# EAGLE schematic TurtleBoard (EAGLE 7.7.0)
REV: 1V1

## Sheet 1 of 7
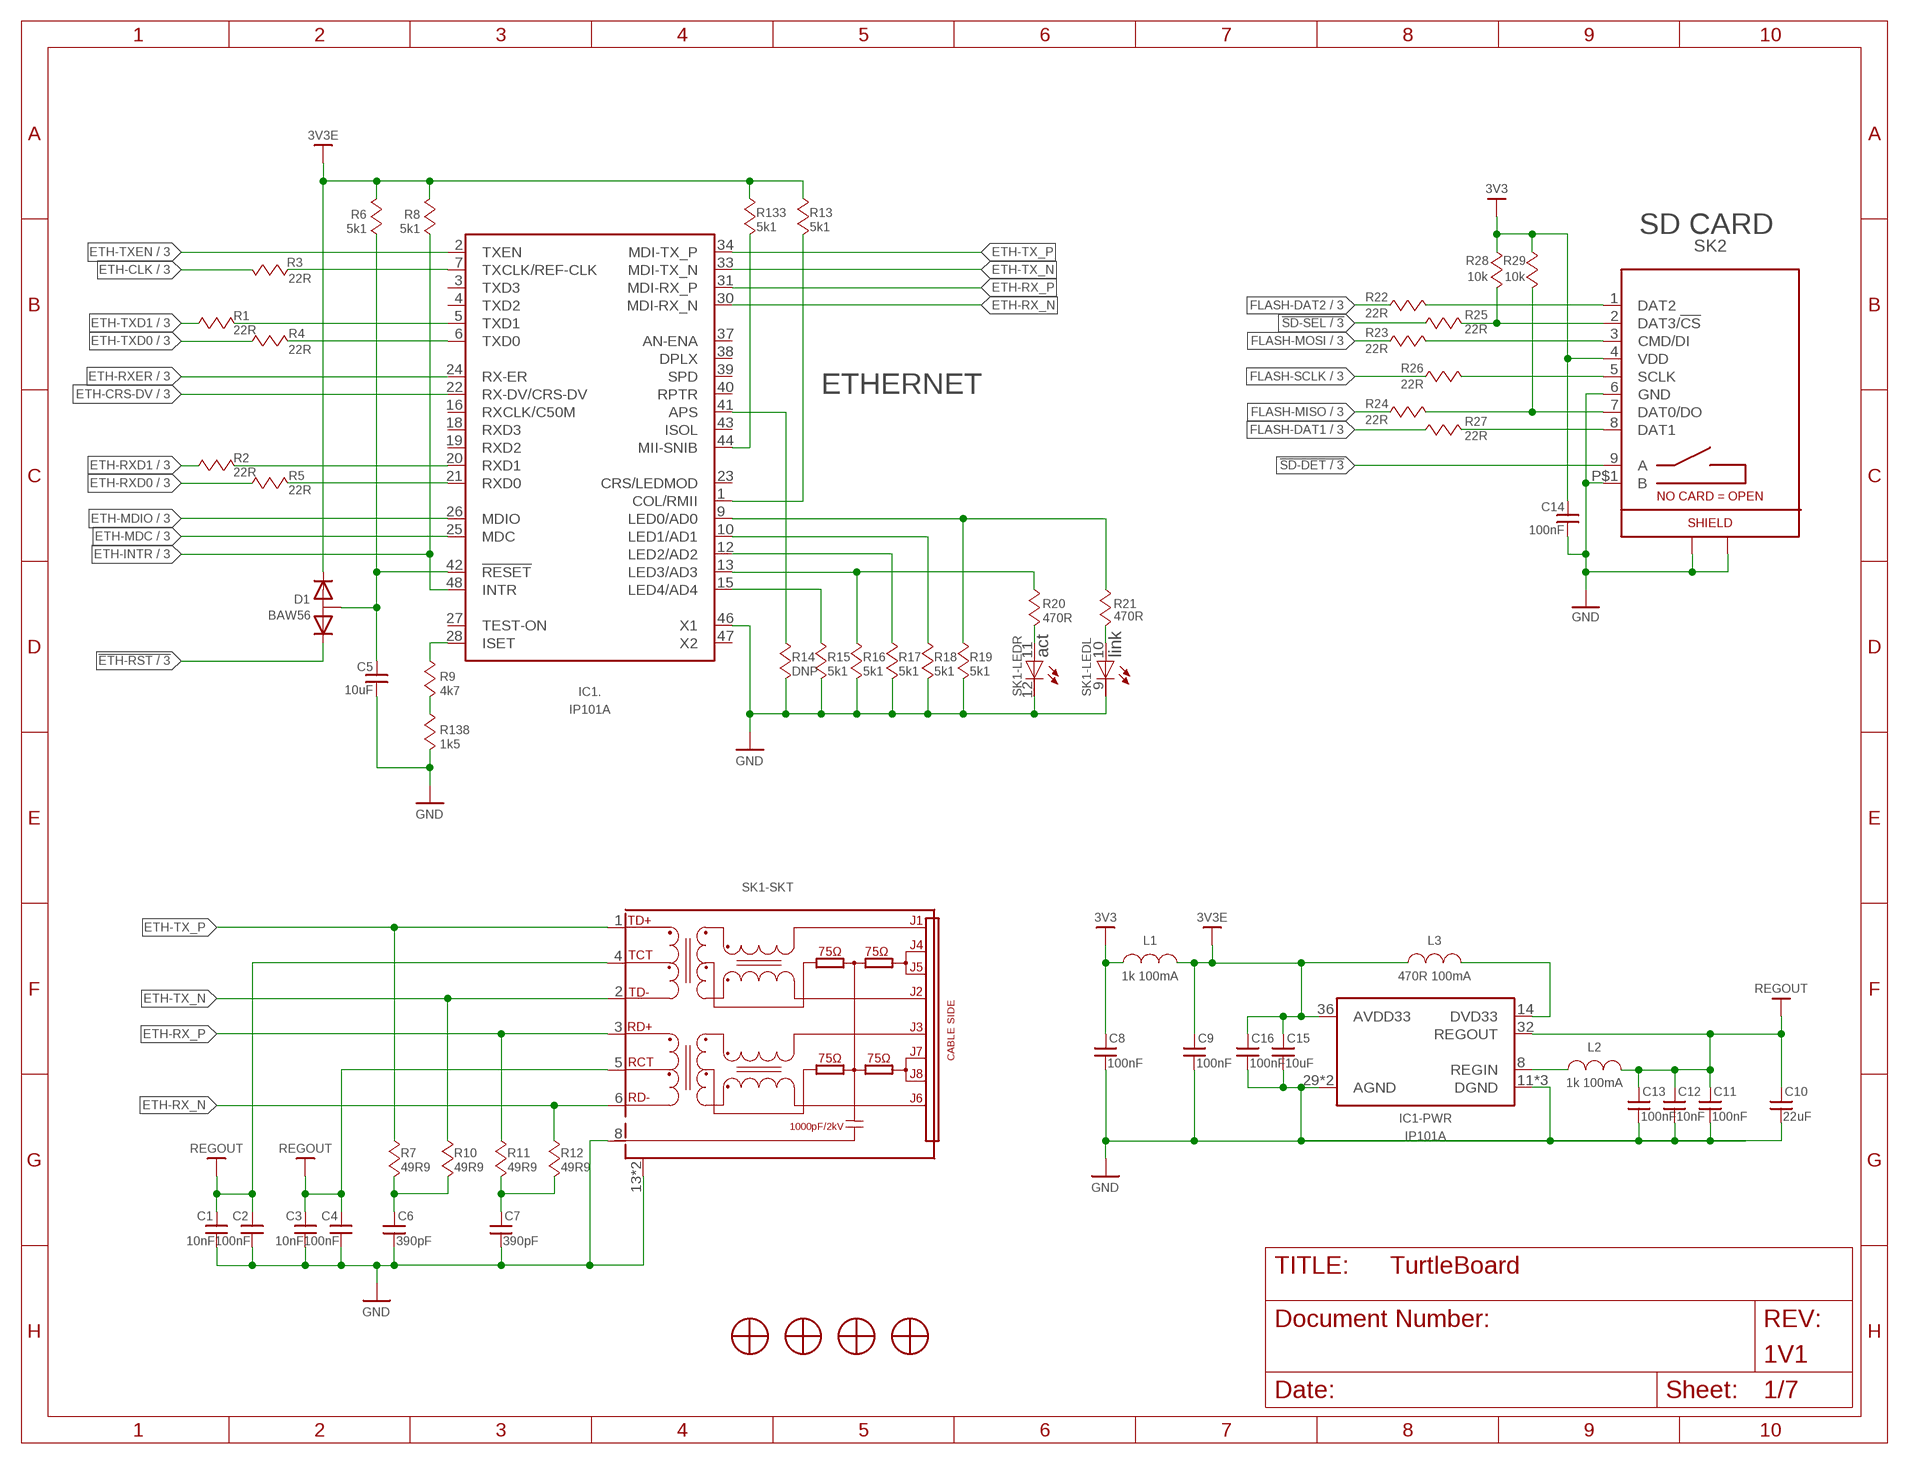
[diagram p0: schematic, sheet 1]

### Parts
C1  10nF  C-0402  [0402]
C2  100nF  C-0402  [0402]
C3  10nF  C-0402  [0402]
C4  100nF  C-0402  [0402]
C5  10uF  C805  [0805]
C6  390pF  C-0402  [0402]
C7  390pF  C-0402  [0402]
C8  100nF  C-0402  [0402]
C9  100nF  C-0402  [0402]
C10  22uF  C805  [0805]
C11  100nF  C-0402  [0402]
C12  10nF  C-0402  [0402]
C13  100nF  C-0402  [0402]
C14  100nF  C-0402  [0402]
C15  10uF  C805  [0805]
C16  100nF  C-0402  [0402]
D1  BAW56  D-DUAL-COMMON-ANODESC-75  [SC-75]
H1  MOUNTING-SCREW-M2.5  [SCREW-M2.5]
H2  MOUNTING-SCREW-M2.5  [SCREW-M2.5]
H3  MOUNTING-SCREW-M2.5  [SCREW-M2.5]
H4  MOUNTING-SCREW-M2.5  [SCREW-M2.5]
IC1  IP101A  [LQFP48]
L1  1k 100mA  L-0402  [0402]
L2  1k 100mA  L-0402  [0402]
L3  470R 100mA  L-603  [0603]
R1  22R  R-0402  [0402]
R2  22R  R-0402  [0402]
R3  22R  R-0402  [0402]
R4  22R  R-0402  [0402]
R5  22R  R-0402  [0402]
R6  5k1  R-0402  [0402]
R7  49R9  R-0402  [0402]
R8  5k1  R-0402  [0402]
R9  4k7  R-0402  [0402]
R10  49R9  R-0402  [0402]
R11  49R9  R-0402  [0402]
R12  49R9  R-0402  [0402]
R13  5k1  R-0402  [0402]
R14  DNP  R-0402  [0402]
R15  5k1  R-0402  [0402]
R16  5k1  R-0402  [0402]
R17  5k1  R-0402  [0402]
R18  5k1  R-0402  [0402]
R19  5k1  R-0402  [0402]
R20  470R  R-0402  [0402]
R21  470R  R-0402  [0402]
R22  22R  R-0402  [0402]
R23  22R  R-0402  [0402]
R24  22R  R-0402  [0402]
R25  22R  R-0402  [0402]
R26  22R  R-0402  [0402]
R27  22R  R-0402  [0402]
R28  10k  R-0402  [0402]
R29  10k  R-0402  [0402]
R133  5k1  R-0402  [0402]
R138  1k5  R-0402  [0402]
SK1  RJ45+MAG+LED-HR911105A  [RJ45-HR911105A]
SK2  SD-CARD-DETECT-MICRO-ALIEXPRESS  [SD-MICRO-ALIEXPRESS]

### Nets
3V3: C8.2 C14.2 L1.1(C1) R28.2 R29.2 SK2.4(VDD) ; also sheet 2,3,5,7
3V3E: C9.2 C15.2 C16.2 D1.1(K1) IC1.36(-PWR:AVDD33) L1.2(C2) L3.2(C2) R6.2 R8.2 R13.2 R133.2
!ETH-RST: D1.2(K2) ; also sheet 3
!SD-DET: SK2.9(A) ; also sheet 3
!SD-SEL: R25.1 ; also sheet 3,7
ETH-CLK: R3.1 ; also sheet 3
ETH-CRS-DV: IC1.22(.:RX-DV/CRS-DV) ; also sheet 3
ETH-INTR: IC1.48(.:INTR) R8.1 ; also sheet 3
ETH-LED0: R21.1 SK1.10(-LEDL:G)
ETH-MDC: IC1.25(.:MDC) ; also sheet 3
ETH-MDIO: IC1.26(.:MDIO) ; also sheet 3
ETH-RX_N: IC1.30(.:MDI-RX_N) R12.2 SK1.6(-SKT:RD-)
ETH-RX_P: IC1.31(.:MDI-RX_P) R11.2 SK1.3(-SKT:RD+)
ETH-RXD0: R5.2 ; also sheet 3
ETH-RXD1: R2.2 ; also sheet 3
ETH-RXER: IC1.24(.:RX-ER) ; also sheet 3
ETH-TX_N: IC1.33(.:MDI-TX_N) R10.2 SK1.2(-SKT:TD-)
ETH-TX_P: IC1.34(.:MDI-TX_P) R7.2 SK1.1(-SKT:TD+)
ETH-TXD0: R4.2 ; also sheet 3
ETH-TXD1: R1.2 ; also sheet 3
ETH-TXEN: IC1.2(.:TXEN) ; also sheet 3
FLASH-DAT1: R27.1 ; also sheet 3
FLASH-DAT2: R22.1 ; also sheet 3
FLASH-MISO: R24.1 ; also sheet 3,7
FLASH-MOSI: R23.1 ; also sheet 3,7
FLASH-SCLK: R26.1 ; also sheet 3,7
GND: C1.1 C2.1 C3.1 C4.1 C5.1 C6.1 C7.1 C8.1 C9.1 C10.1 C11.1 C12.1 C13.1 C14.1 C15.1 C16.1 IC1.11(-PWR:DGND) IC1.17(-PWR:DGND) IC1.29(-PWR:AGND) IC1.35(-PWR:AGND) IC1.45(-PWR:DGND) IC1.46(.:X1) R14.1 R15.1 R16.1 R17.1 R18.1 R19.1 R138.1 SK1.8(-SKT:SH) SK1.9(-LEDL:C) SK1.12(-LEDR:C) SK1.13 SK1.14 SK2.6(GND) SK2.P$1(B) SK2.P$2 SK2.P$3 SK2.P$4 ; also sheet 2,3,4,5,6,7
N$1: IC1.5(.:TXD1) R1.1
N$2: IC1.21(.:RXD0) R5.1
N$3: C5.2 D1.3(A) IC1.42(.:!RESET) R6.1
N$5: R25.2 R28.1 SK2.2(DAT3/!CS)
N$6: IC1.7(.:TXCLK/REF-CLK) R3.2
N$7: R24.2 R29.1 SK2.7(DAT0/DO)
N$8: IC1.15(.:LED4/AD4) R15.2
N$9: IC1.13(.:LED3/AD3) R16.2 R20.2
N$11: IC1.12(.:LED2/AD2) R17.2
N$12: IC1.10(.:LED1/AD1) R18.2
N$14: IC1.6(.:TXD0) R4.1
N$17: IC1.20(.:RXD1) R2.1
N$20: R27.2 SK2.8(DAT1)
N$21: R26.2 SK2.5(SCLK)
N$22: R23.2 SK2.3(CMD/DI)
N$23: R22.2 SK2.1(DAT2)
N$31: IC1.9(.:LED0/AD0) R19.2 R21.2
N$32: IC1.28(.:ISET) R9.2
N$33: IC1.41(.:APS) R14.2
N$34: IC1.44(.:MII-SNIB) R133.1
N$35: IC1.8(-PWR:REGIN) L2.2(C2)
N$36: IC1.1(.:COL/RMII) R13.1
N$42: C7.2 R11.1 R12.1
N$44: C6.2 R7.1 R10.1
N$95: IC1.14(-PWR:DVD33) L3.1(C1)
N$96: R20.1 SK1.11(-LEDR:G)
N$97: R9.1 R138.2
REGOUT: C1.2 C2.2 C3.2 C4.2 C10.2 C11.2 C12.2 C13.2 IC1.32(-PWR:REGOUT) L2.1(C1) SK1.4(-SKT:TCT) SK1.5(-SKT:RCT)
Unconnected: H1.P$1 H2.P$1 H3.P$1 H4.P$1 IC1.3(.:TXD3) IC1.4(.:TXD2) IC1.16(.:RXCLK/C50M) IC1.18(.:RXD3) IC1.19(.:RXD2) IC1.23(.:CRS/LEDMOD) IC1.27(.:TEST-ON) IC1.37(.:AN-ENA) IC1.38(.:DPLX) IC1.39(.:SPD) IC1.40(.:RPTR) IC1.43(.:ISOL) IC1.47(.:X2)

### Notes on the sheet
- SD CARD
- ETHERNET
- act | link

## Sheet 2 of 7
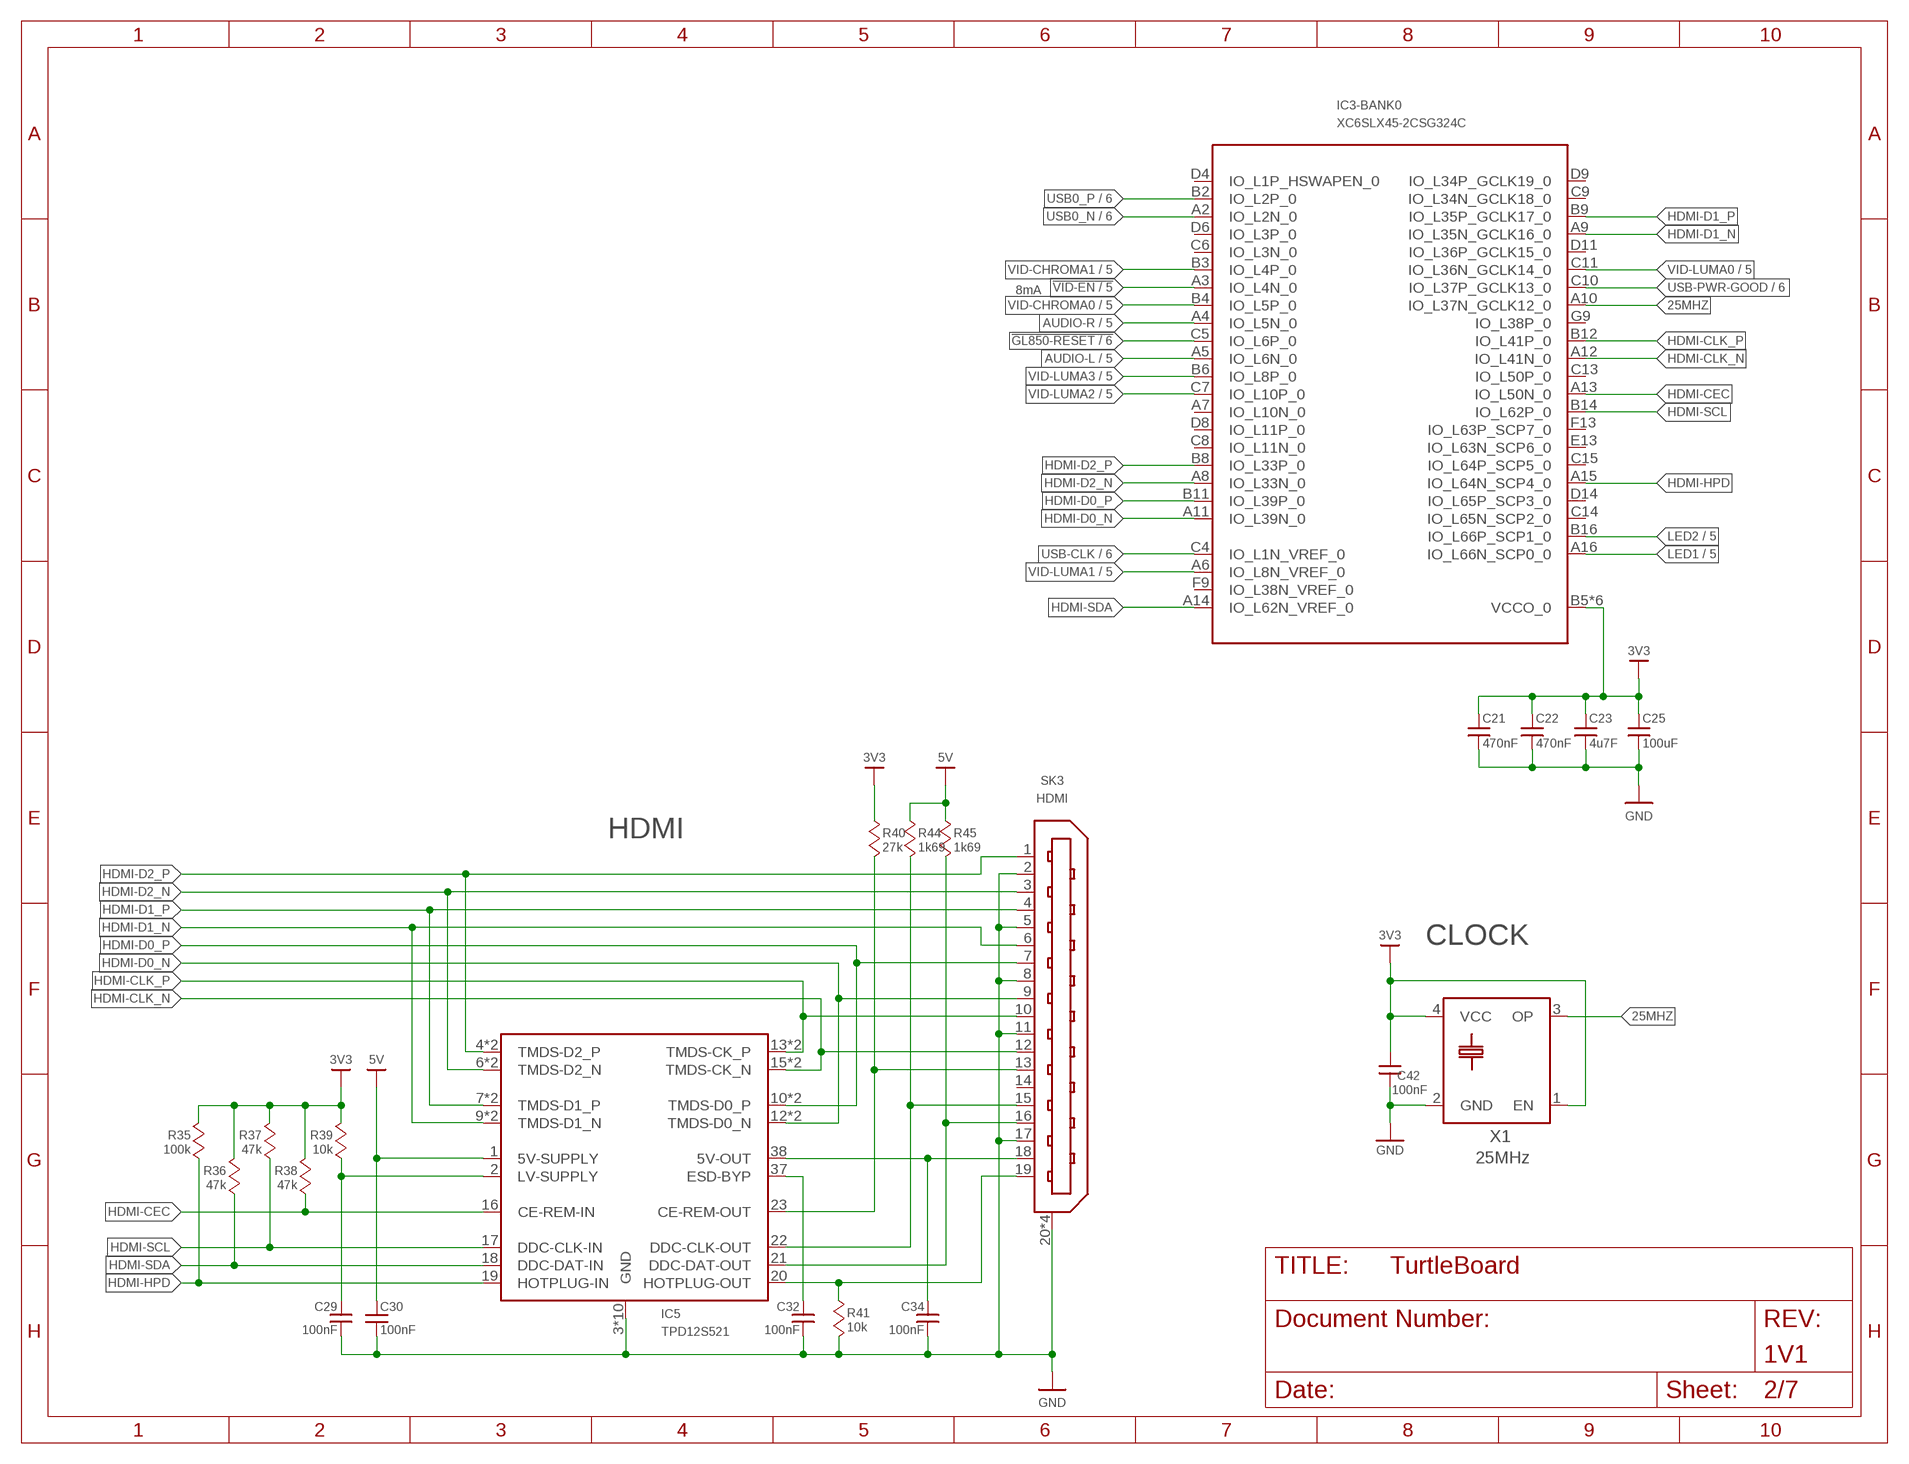
[diagram p1: schematic, sheet 2]

### Parts
C21  470nF  C-0402  [0402]
C22  470nF  C-0402  [0402]
C23  4u7F  C603  [0603]
C25  100uF  C-1206  [1206]
C29  100nF  C-0402  [0402]
C30  100nF  C-0402  [0402]
C32  100nF  C-0402  [0402]
C34  100nF  C-0402  [0402]
C42  100nF  C-0402  [0402]
IC3  XC6SLX45-2CSG324C  XC6SLX-CSG324-CSG324  [CSG324]
IC5  TPD12S521  [TSSOP38_NOPAD]
R35  100k  R-0402  [0402]
R36  47k  R-0402  [0402]
R37  47k  R-0402  [0402]
R38  47k  R-0402  [0402]
R39  10k  R-0402  [0402]
R40  27k  R-0402  [0402]
R41  10k  R-0402  [0402]
R44  1k69  R-0402  [0402]
R45  1k69  R-0402  [0402]
SK3  HDMI  [HDMI]
X1  25MHz  CRYSTAL+EN32X25  [XTAL-SMD-32X25]

### Nets
3V3: C21.1 C22.1 C23.1 C25.1 C42.2 IC3.B5(-BANK0:VCCO_0) IC3.B10(-BANK0:VCCO_0) IC3.B15(-BANK0:VCCO_0) IC3.D7(-BANK0:VCCO_0) IC3.D13(-BANK0:VCCO_0) IC3.E10(-BANK0:VCCO_0) R35.2 R36.2 R37.2 R38.2 R39.2 R40.2 X1.1(EN) X1.4(VCC) ; also sheet 1,3,5,7
5V: C30.2 IC5.1(5V-SUPPLY) R44.2 R45.2 ; also sheet 5,6,7
25MHZ: IC3.A10(-BANK0:IO_L37N_GCLK12_0) X1.3(OP)
!GL850-RESET: IC3.C5(-BANK0:IO_L6P_0) ; also sheet 6
!VID-EN: IC3.A3(-BANK0:IO_L4N_0) ; also sheet 5
AUDIO-L: IC3.A5(-BANK0:IO_L6N_0) ; also sheet 5
AUDIO-R: IC3.A4(-BANK0:IO_L5N_0) ; also sheet 5
GND: C21.2 C22.2 C23.2 C25.2 C29.1 C30.1 C32.1 C34.1 C42.1 IC5.3(GND) IC5.5(GND) IC5.8(GND) IC5.11(GND) IC5.14(GND) IC5.25(GND) IC5.28(GND) IC5.31(GND) IC5.34(GND) IC5.36(GND) R41.1 SK3.2 SK3.5 SK3.8 SK3.11 SK3.17 SK3.20 SK3.21 SK3.22 SK3.23 X1.2(GND) ; also sheet 1,3,4,5,6,7
HDMI-CEC: IC3.A13(-BANK0:IO_L50N_0) IC5.16(CE-REM-IN) R38.1
HDMI-CLK_N: IC3.A12(-BANK0:IO_L41N_0) IC5.15(TMDS-CK_N) IC5.24(TMDS-CK_N) SK3.12
HDMI-CLK_P: IC3.B12(-BANK0:IO_L41P_0) IC5.13(TMDS-CK_P) IC5.26(TMDS-CK_P) SK3.10
HDMI-D0_N: IC3.A11(-BANK0:IO_L39N_0) IC5.12(TMDS-D0_N) IC5.27(TMDS-D0_N) SK3.9
HDMI-D0_P: IC3.B11(-BANK0:IO_L39P_0) IC5.10(TMDS-D0_P) IC5.29(TMDS-D0_P) SK3.7
HDMI-D1_N: IC3.A9(-BANK0:IO_L35N_GCLK16_0) IC5.9(TMDS-D1_N) IC5.30(TMDS-D1_N) SK3.6
HDMI-D1_P: IC3.B9(-BANK0:IO_L35P_GCLK17_0) IC5.7(TMDS-D1_P) IC5.32(TMDS-D1_P) SK3.4
HDMI-D2_N: IC3.A8(-BANK0:IO_L33N_0) IC5.6(TMDS-D2_N) IC5.33(TMDS-D2_N) SK3.3
HDMI-D2_P: IC3.B8(-BANK0:IO_L33P_0) IC5.4(TMDS-D2_P) IC5.35(TMDS-D2_P) SK3.1
HDMI-HPD: IC3.A15(-BANK0:IO_L64N_SCP4_0) IC5.19(HOTPLUG-IN) R35.1
HDMI-SCL: IC3.B14(-BANK0:IO_L62P_0) IC5.17(DDC-CLK-IN) R37.1
HDMI-SDA: IC3.A14(-BANK0:IO_L62N_VREF_0) IC5.18(DDC-DAT-IN) R36.1
LED1: IC3.A16(-BANK0:IO_L66N_SCP0_0) ; also sheet 5
LED2: IC3.B16(-BANK0:IO_L66P_SCP1_0) ; also sheet 5
N$4: C29.2 IC5.2(LV-SUPPLY) R39.1
N$53: IC5.23(CE-REM-OUT) R40.1 SK3.13
N$57: IC5.22(DDC-CLK-OUT) R44.1 SK3.15
N$58: IC5.21(DDC-DAT-OUT) R45.1 SK3.16
N$60: IC5.20(HOTPLUG-OUT) R41.2 SK3.19
N$61: C34.2 IC5.38(5V-OUT) SK3.18
N$62: C32.2 IC5.37(ESD-BYP)
USB0_N: IC3.A2(-BANK0:IO_L2N_0) ; also sheet 6
USB0_P: IC3.B2(-BANK0:IO_L2P_0) ; also sheet 6
USB-CLK: IC3.C4(-BANK0:IO_L1N_VREF_0) ; also sheet 6
USB-PWR-GOOD: IC3.C10(-BANK0:IO_L37P_GCLK13_0) ; also sheet 6
VID-CHROMA0: IC3.B4(-BANK0:IO_L5P_0) ; also sheet 5
VID-CHROMA1: IC3.B3(-BANK0:IO_L4P_0) ; also sheet 5
VID-LUMA0: IC3.C11(-BANK0:IO_L36N_GCLK14_0) ; also sheet 5
VID-LUMA1: IC3.A6(-BANK0:IO_L8N_VREF_0) ; also sheet 5
VID-LUMA2: IC3.C7(-BANK0:IO_L10P_0) ; also sheet 5
VID-LUMA3: IC3.B6(-BANK0:IO_L8P_0) ; also sheet 5
Unconnected: IC3.A7(-BANK0:IO_L10N_0) IC3.C6(-BANK0:IO_L3N_0) IC3.C8(-BANK0:IO_L11N_0) IC3.C9(-BANK0:IO_L34N_GCLK18_0) IC3.C13(-BANK0:IO_L50P_0) IC3.C14(-BANK0:IO_L65N_SCP2_0) IC3.C15(-BANK0:IO_L64P_SCP5_0) IC3.D4(-BANK0:IO_L1P_HSWAPEN_0) IC3.D6(-BANK0:IO_L3P_0) IC3.D8(-BANK0:IO_L11P_0) IC3.D9(-BANK0:IO_L34P_GCLK19_0) IC3.D11(-BANK0:IO_L36P_GCLK15_0) IC3.D14(-BANK0:IO_L65P_SCP3_0) IC3.E13(-BANK0:IO_L63N_SCP6_0) IC3.F9(-BANK0:IO_L38N_VREF_0) IC3.F13(-BANK0:IO_L63P_SCP7_0) IC3.G9(-BANK0:IO_L38P_0) SK3.14

### Notes on the sheet
- 8mA
- HDMI
- CLOCK

## Sheet 3 of 7
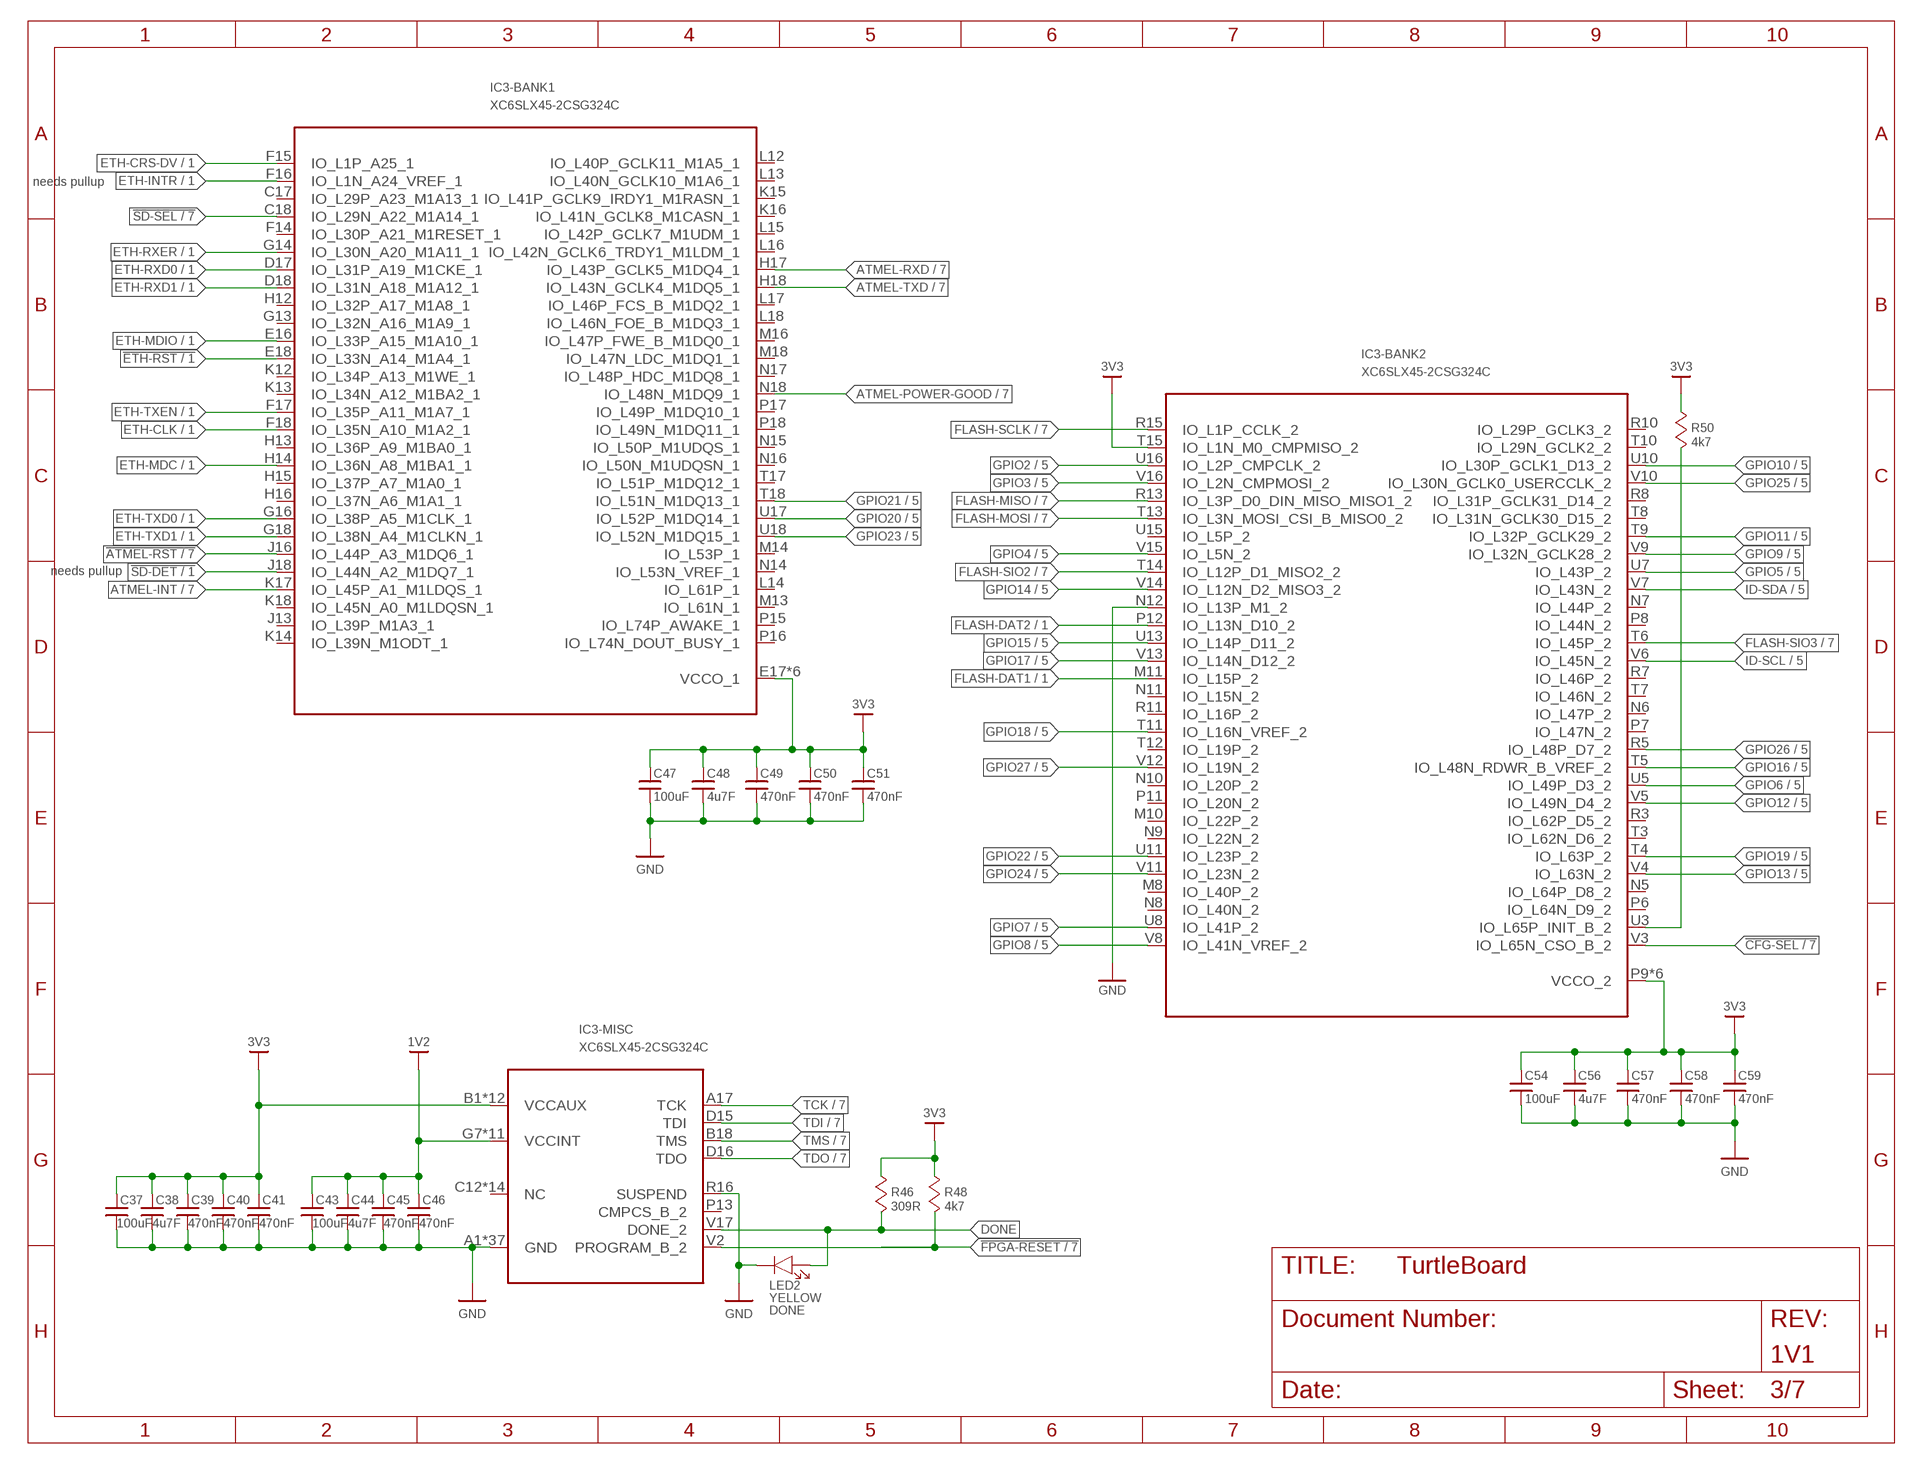
[diagram p2: schematic, sheet 3]

### Parts
C37  100uF  C-1206  [1206]
C38  4u7F  C603  [0603]
C39  470nF  C-0402  [0402]
C40  470nF  C-0402  [0402]
C41  470nF  C-0402  [0402]
C43  100uF  C-1206  [1206]
C44  4u7F  C603  [0603]
C45  470nF  C-0402  [0402]
C46  470nF  C-0402  [0402]
C47  100uF  C-1206  [1206]
C48  4u7F  C603  [0603]
C49  470nF  C-0402  [0402]
C50  470nF  C-0402  [0402]
C51  470nF  C-0402  [0402]
C54  100uF  C-1206  [1206]
C56  4u7F  C603  [0603]
C57  470nF  C-0402  [0402]
C58  470nF  C-0402  [0402]
C59  470nF  C-0402  [0402]
LED2  YELLOW  LED-603  [0603-LED]
R46  309R  R-0402  [0402]
R48  4k7  R-0402  [0402]
R50  4k7  R-0402  [0402]

### Nets
1V2: C43.1 C44.1 C45.1 C46.1 IC3.G7(-MISC:VCCINT) IC3.H9(-MISC:VCCINT) IC3.H11(-MISC:VCCINT) IC3.J8(-MISC:VCCINT) IC3.J10(-MISC:VCCINT) IC3.K9(-MISC:VCCINT) IC3.K11(-MISC:VCCINT) IC3.L8(-MISC:VCCINT) IC3.L10(-MISC:VCCINT) IC3.M7(-MISC:VCCINT) IC3.M12(-MISC:VCCINT) ; also sheet 7
3V3: C37.1 C38.1 C39.1 C40.1 C41.1 C47.1 C48.1 C49.1 C50.1 C51.1 C54.1 C56.1 C57.1 C58.1 C59.1 IC3.B1(-MISC:VCCAUX) IC3.B17(-MISC:VCCAUX) IC3.E5(-MISC:VCCAUX) IC3.E9(-MISC:VCCAUX) IC3.E14(-MISC:VCCAUX) IC3.E17(-BANK1:VCCO_1) IC3.G10(-MISC:VCCAUX) IC3.G15(-BANK1:VCCO_1) IC3.J12(-MISC:VCCAUX) IC3.J14(-BANK1:VCCO_1) IC3.J17(-BANK1:VCCO_1) IC3.K7(-MISC:VCCAUX) IC3.M9(-MISC:VCCAUX) IC3.M15(-BANK1:VCCO_1) IC3.P5(-MISC:VCCAUX) IC3.P9(-BANK2:VCCO_2) IC3.P10(-MISC:VCCAUX) IC3.P14(-MISC:VCCAUX) IC3.R6(-BANK2:VCCO_2) IC3.R12(-BANK2:VCCO_2) IC3.R17(-BANK1:VCCO_1) IC3.T15(-BANK2:IO_L1N_M0_CMPMISO_2) IC3.U4(-BANK2:VCCO_2) IC3.U9(-BANK2:VCCO_2) IC3.U14(-BANK2:VCCO_2) R46.2 R48.2 R50.2 ; also sheet 1,2,5,7
!ATMEL-RST: IC3.J16(-BANK1:IO_L44P_A3_M1DQ6_1) ; also sheet 7
!CFG-SEL: IC3.V3(-BANK2:IO_L65N_CSO_B_2) ; also sheet 7
!ETH-RST: IC3.E18(-BANK1:IO_L33N_A14_M1A4_1) ; also sheet 1
!FPGA-RESET: IC3.V2(-MISC:PROGRAM_B_2) R48.1 ; also sheet 7
!SD-DET: IC3.J18(-BANK1:IO_L44N_A2_M1DQ7_1) ; also sheet 1
!SD-SEL: IC3.C18(-BANK1:IO_L29N_A22_M1A14_1) ; also sheet 1,7
ATMEL-INT: IC3.K17(-BANK1:IO_L45P_A1_M1LDQS_1) ; also sheet 7
ATMEL-POWER-GOOD: IC3.N18(-BANK1:IO_L48N_M1DQ9_1) ; also sheet 7
ATMEL-RXD: IC3.H17(-BANK1:IO_L43P_GCLK5_M1DQ4_1) ; also sheet 7
ATMEL-TXD: IC3.H18(-BANK1:IO_L43N_GCLK4_M1DQ5_1) ; also sheet 7
DONE: IC3.V17(-MISC:DONE_2) LED2.A R46.1
ETH-CLK: IC3.F18(-BANK1:IO_L35N_A10_M1A2_1) ; also sheet 1
ETH-CRS-DV: IC3.F15(-BANK1:IO_L1P_A25_1) ; also sheet 1
ETH-INTR: IC3.F16(-BANK1:IO_L1N_A24_VREF_1) ; also sheet 1
ETH-MDC: IC3.H14(-BANK1:IO_L36N_A8_M1BA1_1) ; also sheet 1
ETH-MDIO: IC3.E16(-BANK1:IO_L33P_A15_M1A10_1) ; also sheet 1
ETH-RXD0: IC3.D17(-BANK1:IO_L31P_A19_M1CKE_1) ; also sheet 1
ETH-RXD1: IC3.D18(-BANK1:IO_L31N_A18_M1A12_1) ; also sheet 1
ETH-RXER: IC3.G14(-BANK1:IO_L30N_A20_M1A11_1) ; also sheet 1
ETH-TXD0: IC3.G16(-BANK1:IO_L38P_A5_M1CLK_1) ; also sheet 1
ETH-TXD1: IC3.G18(-BANK1:IO_L38N_A4_M1CLKN_1) ; also sheet 1
ETH-TXEN: IC3.F17(-BANK1:IO_L35P_A11_M1A7_1) ; also sheet 1
FLASH-DAT1: IC3.M11(-BANK2:IO_L15P_2) ; also sheet 1
FLASH-DAT2: IC3.P12(-BANK2:IO_L13N_D10_2) ; also sheet 1
FLASH-MISO: IC3.R13(-BANK2:IO_L3P_D0_DIN_MISO_MISO1_2) ; also sheet 1,7
FLASH-MOSI: IC3.T13(-BANK2:IO_L3N_MOSI_CSI_B_MISO0_2) ; also sheet 1,7
FLASH-SCLK: IC3.R15(-BANK2:IO_L1P_CCLK_2) ; also sheet 1,7
FLASH-SIO2: IC3.T14(-BANK2:IO_L12P_D1_MISO2_2) ; also sheet 7
FLASH-SIO3: IC3.T6(-BANK2:IO_L45P_2) ; also sheet 7
GND: C37.2 C38.2 C39.2 C40.2 C41.2 C43.2 C44.2 C45.2 C46.2 C47.2 C48.2 C49.2 C50.2 C51.2 C54.2 C56.2 C57.2 C58.2 C59.2 IC3.A1(-MISC:GND) IC3.A18(-MISC:GND) IC3.B7(-MISC:GND) IC3.B13(-MISC:GND) IC3.C3(-MISC:GND) IC3.C16(-MISC:GND) IC3.D5(-MISC:GND) IC3.D10(-MISC:GND) IC3.E15(-MISC:GND) IC3.G2(-MISC:GND) IC3.G5(-MISC:GND) IC3.G12(-MISC:GND) IC3.G17(-MISC:GND) IC3.H8(-MISC:GND) IC3.H10(-MISC:GND) IC3.J4(-MISC:GND) IC3.J9(-MISC:GND) IC3.J11(-MISC:GND) IC3.J15(-MISC:GND) IC3.K8(-MISC:GND) IC3.K10(-MISC:GND) IC3.L9(-MISC:GND) IC3.L11(-MISC:GND) IC3.M2(-MISC:GND) IC3.M6(-MISC:GND) IC3.M17(-MISC:GND) IC3.N12(-BANK2:IO_L13P_M1_2) IC3.N13(-MISC:GND) IC3.R1(-MISC:GND) IC3.R4(-MISC:GND) IC3.R9(-MISC:GND) IC3.R14(-MISC:GND) IC3.R16(-MISC:SUSPEND) IC3.R18(-MISC:GND) IC3.T16(-MISC:GND) IC3.U6(-MISC:GND) IC3.U12(-MISC:GND) IC3.V1(-MISC:GND) IC3.V18(-MISC:GND) LED2.C ; also sheet 1,2,4,5,6,7
GPIO2: IC3.U16(-BANK2:IO_L2P_CMPCLK_2) ; also sheet 5
GPIO3: IC3.V16(-BANK2:IO_L2N_CMPMOSI_2) ; also sheet 5
GPIO4: IC3.V15(-BANK2:IO_L5N_2) ; also sheet 5
GPIO5: IC3.U7(-BANK2:IO_L43P_2) ; also sheet 5
GPIO6: IC3.U5(-BANK2:IO_L49P_D3_2) ; also sheet 5
GPIO7: IC3.U8(-BANK2:IO_L41P_2) ; also sheet 5
GPIO8: IC3.V8(-BANK2:IO_L41N_VREF_2) ; also sheet 5
GPIO9: IC3.V9(-BANK2:IO_L32N_GCLK28_2) ; also sheet 5
GPIO10: IC3.U10(-BANK2:IO_L30P_GCLK1_D13_2) ; also sheet 5
GPIO11: IC3.T9(-BANK2:IO_L32P_GCLK29_2) ; also sheet 5
GPIO12: IC3.V5(-BANK2:IO_L49N_D4_2) ; also sheet 5
GPIO13: IC3.V4(-BANK2:IO_L63N_2) ; also sheet 5
GPIO14: IC3.V14(-BANK2:IO_L12N_D2_MISO3_2) ; also sheet 5
GPIO15: IC3.U13(-BANK2:IO_L14P_D11_2) ; also sheet 5
GPIO16: IC3.T5(-BANK2:IO_L48N_RDWR_B_VREF_2) ; also sheet 5
GPIO17: IC3.V13(-BANK2:IO_L14N_D12_2) ; also sheet 5
GPIO18: IC3.T11(-BANK2:IO_L16N_VREF_2) ; also sheet 5
GPIO19: IC3.T4(-BANK2:IO_L63P_2) ; also sheet 5
GPIO20: IC3.U17(-BANK1:IO_L52P_M1DQ14_1) ; also sheet 5
GPIO21: IC3.T18(-BANK1:IO_L51N_M1DQ13_1) ; also sheet 5
GPIO22: IC3.U11(-BANK2:IO_L23P_2) ; also sheet 5
GPIO23: IC3.U18(-BANK1:IO_L52N_M1DQ15_1) ; also sheet 5
GPIO24: IC3.V11(-BANK2:IO_L23N_2) ; also sheet 5
GPIO25: IC3.V10(-BANK2:IO_L30N_GCLK0_USERCCLK_2) ; also sheet 5
GPIO26: IC3.R5(-BANK2:IO_L48P_D7_2) ; also sheet 5
GPIO27: IC3.V12(-BANK2:IO_L19N_2) ; also sheet 5
ID-SCL: IC3.V6(-BANK2:IO_L45N_2) ; also sheet 5
ID-SDA: IC3.V7(-BANK2:IO_L43N_2) ; also sheet 5
N$66: IC3.U3(-BANK2:IO_L65P_INIT_B_2) R50.1
TCK: IC3.A17(-MISC:TCK) ; also sheet 7
TDI: IC3.D15(-MISC:TDI) ; also sheet 7
TDO: IC3.D16(-MISC:TDO) ; also sheet 7
TMS: IC3.B18(-MISC:TMS) ; also sheet 7
Unconnected: IC3.C12(-MISC:NC) IC3.C17(-BANK1:IO_L29P_A23_M1A13_1) IC3.D12(-MISC:NC) IC3.E6(-MISC:NC) IC3.E7(-MISC:NC) IC3.E8(-MISC:NC) IC3.E11(-MISC:NC) IC3.E12(-MISC:NC) IC3.F7(-MISC:NC) IC3.F8(-MISC:NC) IC3.F10(-MISC:NC) IC3.F11(-MISC:NC) IC3.F12(-MISC:NC) IC3.F14(-BANK1:IO_L30P_A21_M1RESET_1) IC3.G8(-MISC:NC) IC3.G11(-MISC:NC) IC3.G13(-BANK1:IO_L32N_A16_M1A9_1) IC3.H12(-BANK1:IO_L32P_A17_M1A8_1) IC3.H13(-BANK1:IO_L36P_A9_M1BA0_1) IC3.H15(-BANK1:IO_L37P_A7_M1A0_1) IC3.H16(-BANK1:IO_L37N_A6_M1A1_1) IC3.J13(-BANK1:IO_L39P_M1A3_1) IC3.K12(-BANK1:IO_L34P_A13_M1WE_1) IC3.K13(-BANK1:IO_L34N_A12_M1BA2_1) IC3.K14(-BANK1:IO_L39N_M1ODT_1) IC3.K15(-BANK1:IO_L41P_GCLK9_IRDY1_M1RASN_1) IC3.K16(-BANK1:IO_L41N_GCLK8_M1CASN_1) IC3.K18(-BANK1:IO_L45N_A0_M1LDQSN_1) IC3.L12(-BANK1:IO_L40P_GCLK11_M1A5_1) IC3.L13(-BANK1:IO_L40N_GCLK10_M1A6_1) IC3.L14(-BANK1:IO_L61P_1) IC3.L15(-BANK1:IO_L42P_GCLK7_M1UDM_1) IC3.L16(-BANK1:IO_L42N_GCLK6_TRDY1_M1LDM_1) IC3.L17(-BANK1:IO_L46P_FCS_B_M1DQ2_1) IC3.L18(-BANK1:IO_L46N_FOE_B_M1DQ3_1) IC3.M8(-BANK2:IO_L40P_2) IC3.M10(-BANK2:IO_L22P_2) IC3.M13(-BANK1:IO_L61N_1) IC3.M14(-BANK1:IO_L53P_1) IC3.M16(-BANK1:IO_L47P_FWE_B_M1DQ0_1) IC3.M18(-BANK1:IO_L47N_LDC_M1DQ1_1) IC3.N5(-BANK2:IO_L64P_D8_2) IC3.N6(-BANK2:IO_L47P_2) IC3.N7(-BANK2:IO_L44P_2) IC3.N8(-BANK2:IO_L40N_2) IC3.N9(-BANK2:IO_L22N_2) IC3.N10(-BANK2:IO_L20P_2) IC3.N11(-BANK2:IO_L15N_2) IC3.N14(-BANK1:IO_L53N_VREF_1) IC3.N15(-BANK1:IO_L50P_M1UDQS_1) IC3.N16(-BANK1:IO_L50N_M1UDQSN_1) IC3.N17(-BANK1:IO_L48P_HDC_M1DQ8_1) IC3.P6(-BANK2:IO_L64N_D9_2) IC3.P7(-BANK2:IO_L47N_2) IC3.P8(-BANK2:IO_L44N_2) IC3.P11(-BANK2:IO_L20N_2) IC3.P13(-MISC:CMPCS_B_2) IC3.P15(-BANK1:IO_L74P_AWAKE_1) IC3.P16(-BANK1:IO_L74N_DOUT_BUSY_1) IC3.P17(-BANK1:IO_L49P_M1DQ10_1) IC3.P18(-BANK1:IO_L49N_M1DQ11_1) IC3.R3(-BANK2:IO_L62P_D5_2) IC3.R7(-BANK2:IO_L46P_2) IC3.R8(-BANK2:IO_L31P_GCLK31_D14_2) IC3.R10(-BANK2:IO_L29P_GCLK3_2) IC3.R11(-BANK2:IO_L16P_2) IC3.T3(-BANK2:IO_L62N_D6_2) IC3.T7(-BANK2:IO_L46N_2) IC3.T8(-BANK2:IO_L31N_GCLK30_D15_2) IC3.T10(-BANK2:IO_L29N_GCLK2_2) IC3.T12(-BANK2:IO_L19P_2) IC3.T17(-BANK1:IO_L51P_M1DQ12_1) IC3.U15(-BANK2:IO_L5P_2)

### Notes on the sheet
- needs pullup
- needs pullup
- DONE

## Sheet 4 of 7
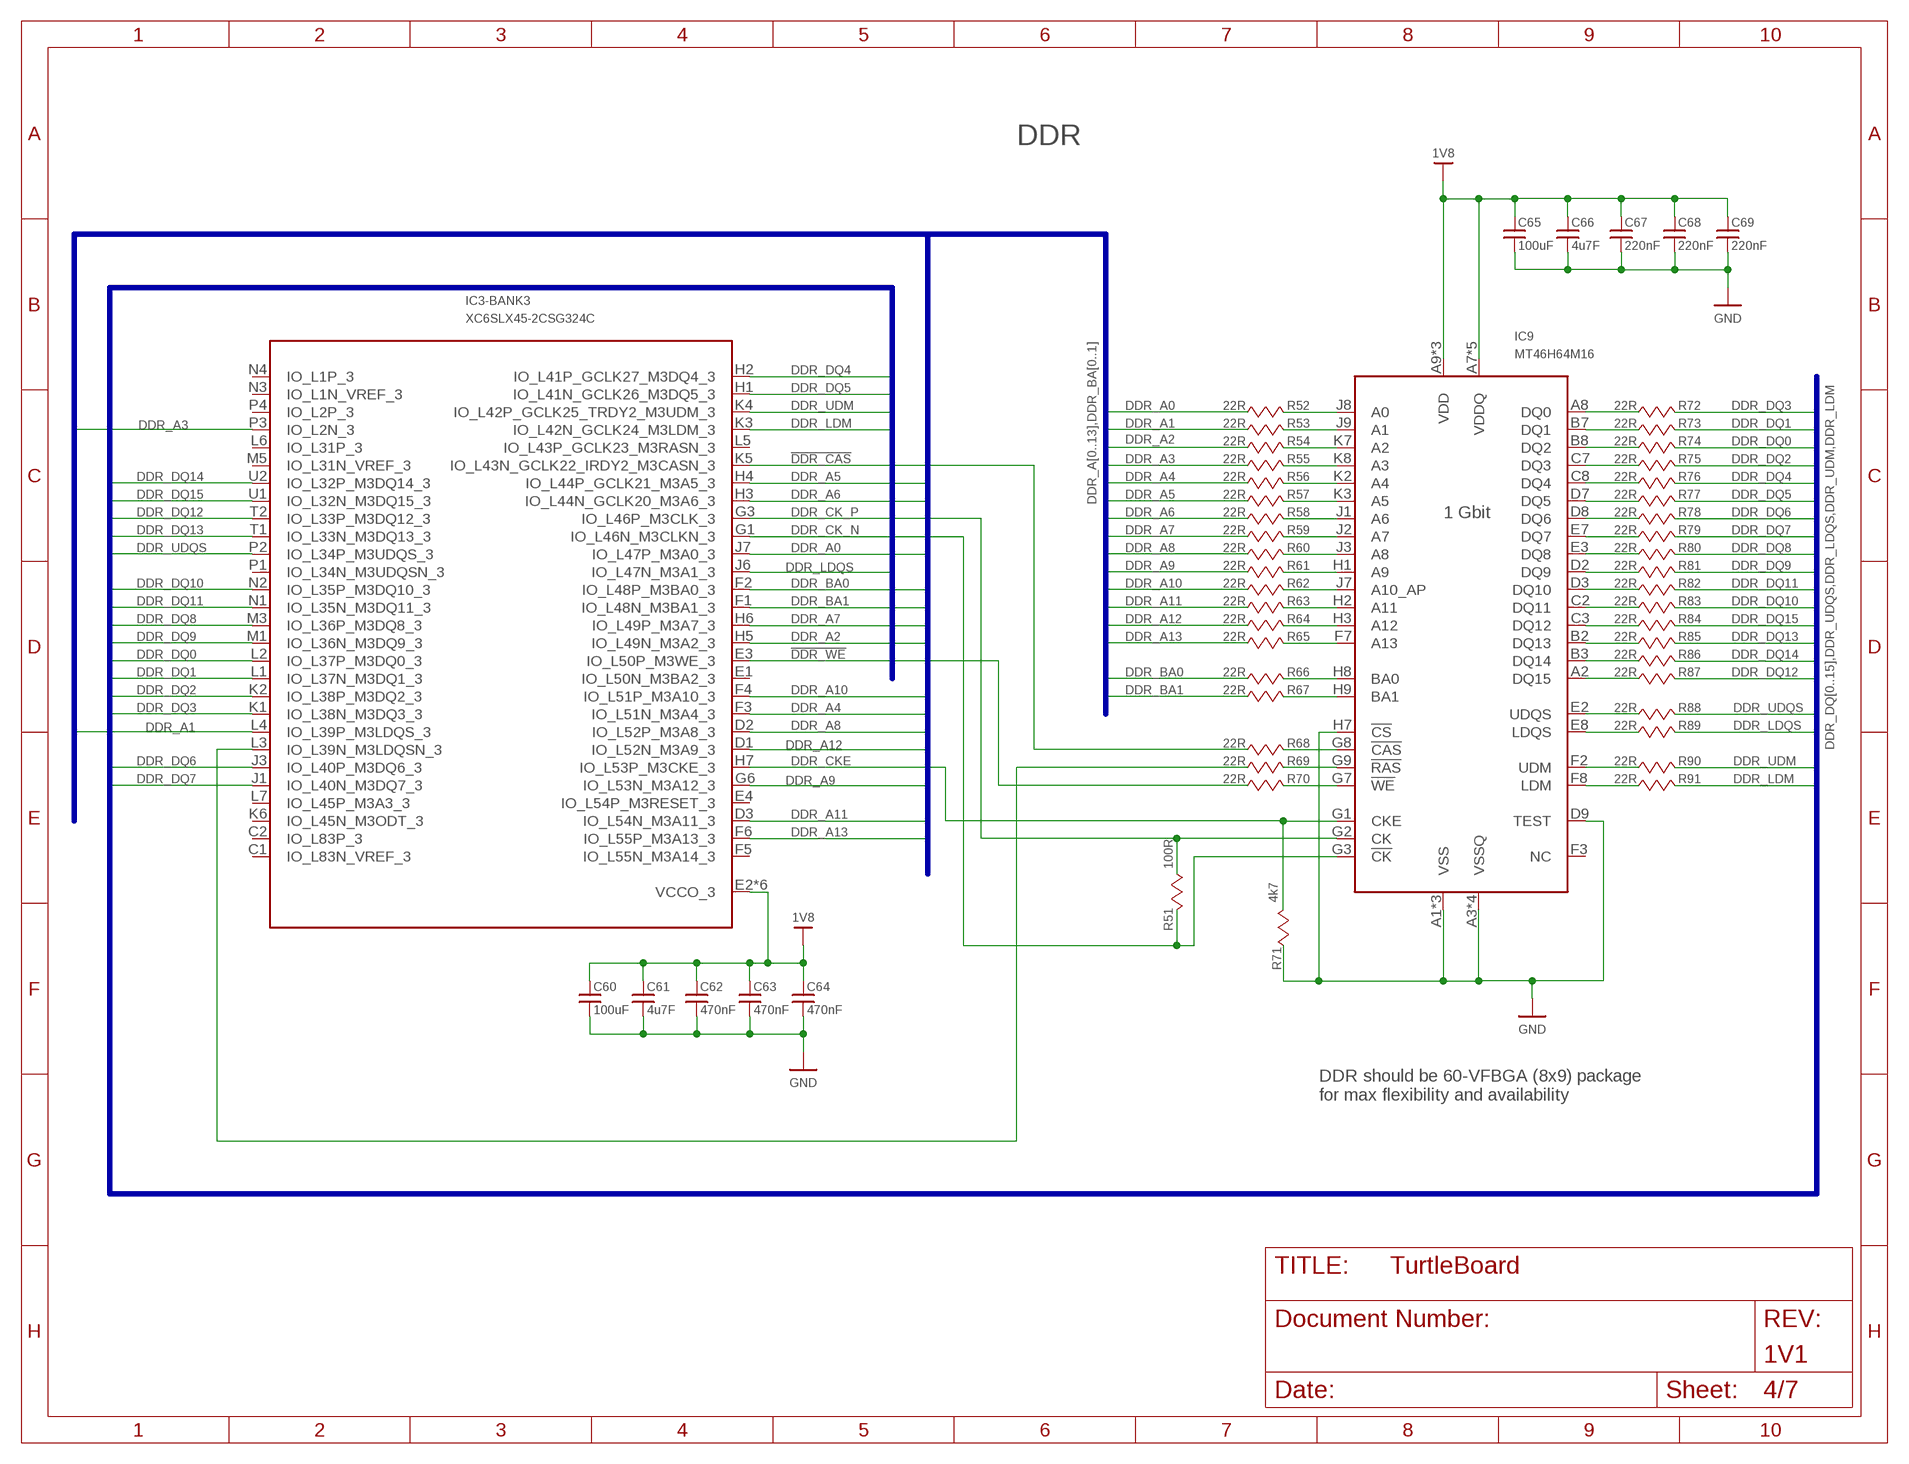
[diagram p3: schematic, sheet 4]

### Parts
C60  100uF  C-1206  [1206]
C61  4u7F  C603  [0603]
C62  470nF  C-0402  [0402]
C63  470nF  C-0402  [0402]
C64  470nF  C-0402  [0402]
C65  100uF  C-1206  [1206]
C66  4u7F  C603  [0603]
C67  220nF  C-0402  [0402]
C68  220nF  C-0402  [0402]
C69  220nF  C-0402  [0402]
IC9  MT46H64M16  [VBGA-60]
R51  100R  R-0402  [0402]
R52  22R  R-0402  [0402]
R53  22R  R-0402  [0402]
R54  22R  R-0402  [0402]
R55  22R  R-0402  [0402]
R56  22R  R-0402  [0402]
R57  22R  R-0402  [0402]
R58  22R  R-0402  [0402]
R59  22R  R-0402  [0402]
R60  22R  R-0402  [0402]
R61  22R  R-0402  [0402]
R62  22R  R-0402  [0402]
R63  22R  R-0402  [0402]
R64  22R  R-0402  [0402]
R65  22R  R-0402  [0402]
R66  22R  R-0402  [0402]
R67  22R  R-0402  [0402]
R68  22R  R-0402  [0402]
R69  22R  R-0402  [0402]
R70  22R  R-0402  [0402]
R71  4k7  R-0402  [0402]
R72  22R  R-0402  [0402]
R73  22R  R-0402  [0402]
R74  22R  R-0402  [0402]
R75  22R  R-0402  [0402]
R76  22R  R-0402  [0402]
R77  22R  R-0402  [0402]
R78  22R  R-0402  [0402]
R79  22R  R-0402  [0402]
R80  22R  R-0402  [0402]
R81  22R  R-0402  [0402]
R82  22R  R-0402  [0402]
R83  22R  R-0402  [0402]
R84  22R  R-0402  [0402]
R85  22R  R-0402  [0402]
R86  22R  R-0402  [0402]
R87  22R  R-0402  [0402]
R88  22R  R-0402  [0402]
R89  22R  R-0402  [0402]
R90  22R  R-0402  [0402]
R91  22R  R-0402  [0402]

### Nets
1V8: C60.1 C61.1 C62.1 C63.1 C64.1 C65.1 C66.1 C67.1 C68.1 C69.1 IC3.E2(-BANK3:VCCO_3) IC3.G4(-BANK3:VCCO_3) IC3.J2(-BANK3:VCCO_3) IC3.J5(-BANK3:VCCO_3) IC3.M4(-BANK3:VCCO_3) IC3.R2(-BANK3:VCCO_3) IC9.A7(VDDQ) IC9.A9(VDD) IC9.B1(VDDQ) IC9.C9(VDDQ) IC9.D1(VDDQ) IC9.E9(VDDQ) IC9.F9(VDD) IC9.K9(VDD) ; also sheet 7
!DDR_CAS: IC3.K5(-BANK3:IO_L43N_GCLK22_IRDY2_M3CASN_3) R68.1
!DDR_CASB: IC9.G8(!CAS) R68.2
!DDR_RAS: IC3.L3(-BANK3:IO_L39N_M3LDQSN_3) R69.1
!DDR_RASB: IC9.G9(!RAS) R69.2
!DDR_WE: IC3.E3(-BANK3:IO_L50P_M3WE_3) R70.1
!DDR_WEB: IC9.G7(!WE) R70.2
DDR_A0: IC3.J7(-BANK3:IO_L47P_M3A0_3) R52.1
DDR_A0B: IC9.J8(A0) R52.2
DDR_A1: IC3.L4(-BANK3:IO_L39P_M3LDQS_3) R53.1
DDR_A1B: IC9.J9(A1) R53.2
DDR_A2: IC3.H5(-BANK3:IO_L49N_M3A2_3) R54.1
DDR_A2B: IC9.K7(A2) R54.2
DDR_A3: IC3.P3(-BANK3:IO_L2N_3) R55.1
DDR_A3B: IC9.K8(A3) R55.2
DDR_A4: IC3.F3(-BANK3:IO_L51N_M3A4_3) R56.1
DDR_A4B: IC9.K2(A4) R56.2
DDR_A5: IC3.H4(-BANK3:IO_L44P_GCLK21_M3A5_3) R57.1
DDR_A5B: IC9.K3(A5) R57.2
DDR_A6: IC3.H3(-BANK3:IO_L44N_GCLK20_M3A6_3) R58.1
DDR_A6B: IC9.J1(A6) R58.2
DDR_A7: IC3.H6(-BANK3:IO_L49P_M3A7_3) R59.1
DDR_A7B: IC9.J2(A7) R59.2
DDR_A8: IC3.D2(-BANK3:IO_L52P_M3A8_3) R60.1
DDR_A8B: IC9.J3(A8) R60.2
DDR_A9: IC3.G6(-BANK3:IO_L53N_M3A12_3) R61.1
DDR_A9B: IC9.H1(A9) R61.2
DDR_A10: IC3.F4(-BANK3:IO_L51P_M3A10_3) R62.1
DDR_A10B: IC9.J7(A10_AP) R62.2
DDR_A11: IC3.D3(-BANK3:IO_L54N_M3A11_3) R63.1
DDR_A11B: IC9.H2(A11) R63.2
DDR_A12: IC3.D1(-BANK3:IO_L52N_M3A9_3) R64.1
DDR_A12B: IC9.H3(A12) R64.2
DDR_A13: IC3.F6(-BANK3:IO_L55P_M3A13_3) R65.1
DDR_A13B: IC9.F7(A13) R65.2
DDR_BA0: IC3.F2(-BANK3:IO_L48P_M3BA0_3) R66.1
DDR_BA0B: IC9.H8(BA0) R66.2
DDR_BA1: IC3.F1(-BANK3:IO_L48N_M3BA1_3) R67.1
DDR_BA1B: IC9.H9(BA1) R67.2
DDR_CK_N: IC3.G1(-BANK3:IO_L46N_M3CLKN_3) IC9.G3(!CK) R51.2
DDR_CK_P: IC3.G3(-BANK3:IO_L46P_M3CLK_3) IC9.G2(CK) R51.1
DDR_CKE: IC3.H7(-BANK3:IO_L53P_M3CKE_3) IC9.G1(CKE) R71.2
DDR_DQ0: IC3.L2(-BANK3:IO_L37P_M3DQ0_3) R74.2
DDR_DQ0B: IC9.B8(DQ2) R74.1
DDR_DQ1: IC3.L1(-BANK3:IO_L37N_M3DQ1_3) R73.2
DDR_DQ1B: IC9.B7(DQ1) R73.1
DDR_DQ2: IC3.K2(-BANK3:IO_L38P_M3DQ2_3) R75.2
DDR_DQ2B: IC9.C7(DQ3) R75.1
DDR_DQ3: IC3.K1(-BANK3:IO_L38N_M3DQ3_3) R72.2
DDR_DQ3B: IC9.A8(DQ0) R72.1
DDR_DQ4: IC3.H2(-BANK3:IO_L41P_GCLK27_M3DQ4_3) R76.2
DDR_DQ4B: IC9.C8(DQ4) R76.1
DDR_DQ5: IC3.H1(-BANK3:IO_L41N_GCLK26_M3DQ5_3) R77.2
DDR_DQ5B: IC9.D7(DQ5) R77.1
DDR_DQ6: IC3.J3(-BANK3:IO_L40P_M3DQ6_3) R78.2
DDR_DQ6B: IC9.D8(DQ6) R78.1
DDR_DQ7: IC3.J1(-BANK3:IO_L40N_M3DQ7_3) R79.2
DDR_DQ7B: IC9.E7(DQ7) R79.1
DDR_DQ8: IC3.M3(-BANK3:IO_L36P_M3DQ8_3) R80.2
DDR_DQ8B: IC9.E3(DQ8) R80.1
DDR_DQ9: IC3.M1(-BANK3:IO_L36N_M3DQ9_3) R81.2
DDR_DQ9B: IC9.D2(DQ9) R81.1
DDR_DQ10: IC3.N2(-BANK3:IO_L35P_M3DQ10_3) R83.2
DDR_DQ10B: IC9.C2(DQ11) R83.1
DDR_DQ11: IC3.N1(-BANK3:IO_L35N_M3DQ11_3) R82.2
DDR_DQ11B: IC9.D3(DQ10) R82.1
DDR_DQ12: IC3.T2(-BANK3:IO_L33P_M3DQ12_3) R87.2
DDR_DQ12B: IC9.A2(DQ15) R87.1
DDR_DQ13: IC3.T1(-BANK3:IO_L33N_M3DQ13_3) R85.2
DDR_DQ13B: IC9.B2(DQ13) R85.1
DDR_DQ14: IC3.U2(-BANK3:IO_L32P_M3DQ14_3) R86.2
DDR_DQ14B: IC9.B3(DQ14) R86.1
DDR_DQ15: IC3.U1(-BANK3:IO_L32N_M3DQ15_3) R84.2
DDR_DQ15B: IC9.C3(DQ12) R84.1
DDR_LDM: IC3.K3(-BANK3:IO_L42N_GCLK24_M3LDM_3) R91.2
DDR_LDMB: IC9.F8(LDM) R91.1
DDR_LDQS: IC3.J6(-BANK3:IO_L47N_M3A1_3) R89.2
DDR_LDQSB: IC9.E8(LDQS) R89.1
DDR_UDM: IC3.K4(-BANK3:IO_L42P_GCLK25_TRDY2_M3UDM_3) R90.2
DDR_UDMB: IC9.F2(UDM) R90.1
DDR_UDQS: IC3.P2(-BANK3:IO_L34P_M3UDQS_3) R88.2
DDR_UDQSB: IC9.E2(UDQS) R88.1
GND: C60.2 C61.2 C62.2 C63.2 C64.2 C65.2 C66.2 C67.2 C68.2 C69.2 IC9.A1(VSS) IC9.A3(VSSQ) IC9.B9(VSSQ) IC9.C1(VSSQ) IC9.D9(TEST) IC9.E1(VSSQ) IC9.F1(VSS) IC9.H7(!CS) IC9.K1(VSS) R71.1 ; also sheet 1,2,3,5,6,7
Unconnected: IC3.C1(-BANK3:IO_L83N_VREF_3) IC3.C2(-BANK3:IO_L83P_3) IC3.E1(-BANK3:IO_L50N_M3BA2_3) IC3.E4(-BANK3:IO_L54P_M3RESET_3) IC3.F5(-BANK3:IO_L55N_M3A14_3) IC3.K6(-BANK3:IO_L45N_M3ODT_3) IC3.L5(-BANK3:IO_L43P_GCLK23_M3RASN_3) IC3.L6(-BANK3:IO_L31P_3) IC3.L7(-BANK3:IO_L45P_M3A3_3) IC3.M5(-BANK3:IO_L31N_VREF_3) IC3.N3(-BANK3:IO_L1N_VREF_3) IC3.N4(-BANK3:IO_L1P_3) IC3.P1(-BANK3:IO_L34N_M3UDQSN_3) IC3.P4(-BANK3:IO_L2P_3) IC9.F3(NC)

### Buses
DDR_A[0..13],DDR_BA[0..1]
DDR_DQ[0..15],DDR_UDQS,DDR_LDQS,DDR_UDM,DDR_LDM

### Notes on the sheet
- DDR
- 1 Gbit
- DDR should be 60-VFBGA (8x9) package
  for max flexibility and availability

## Sheet 5 of 7
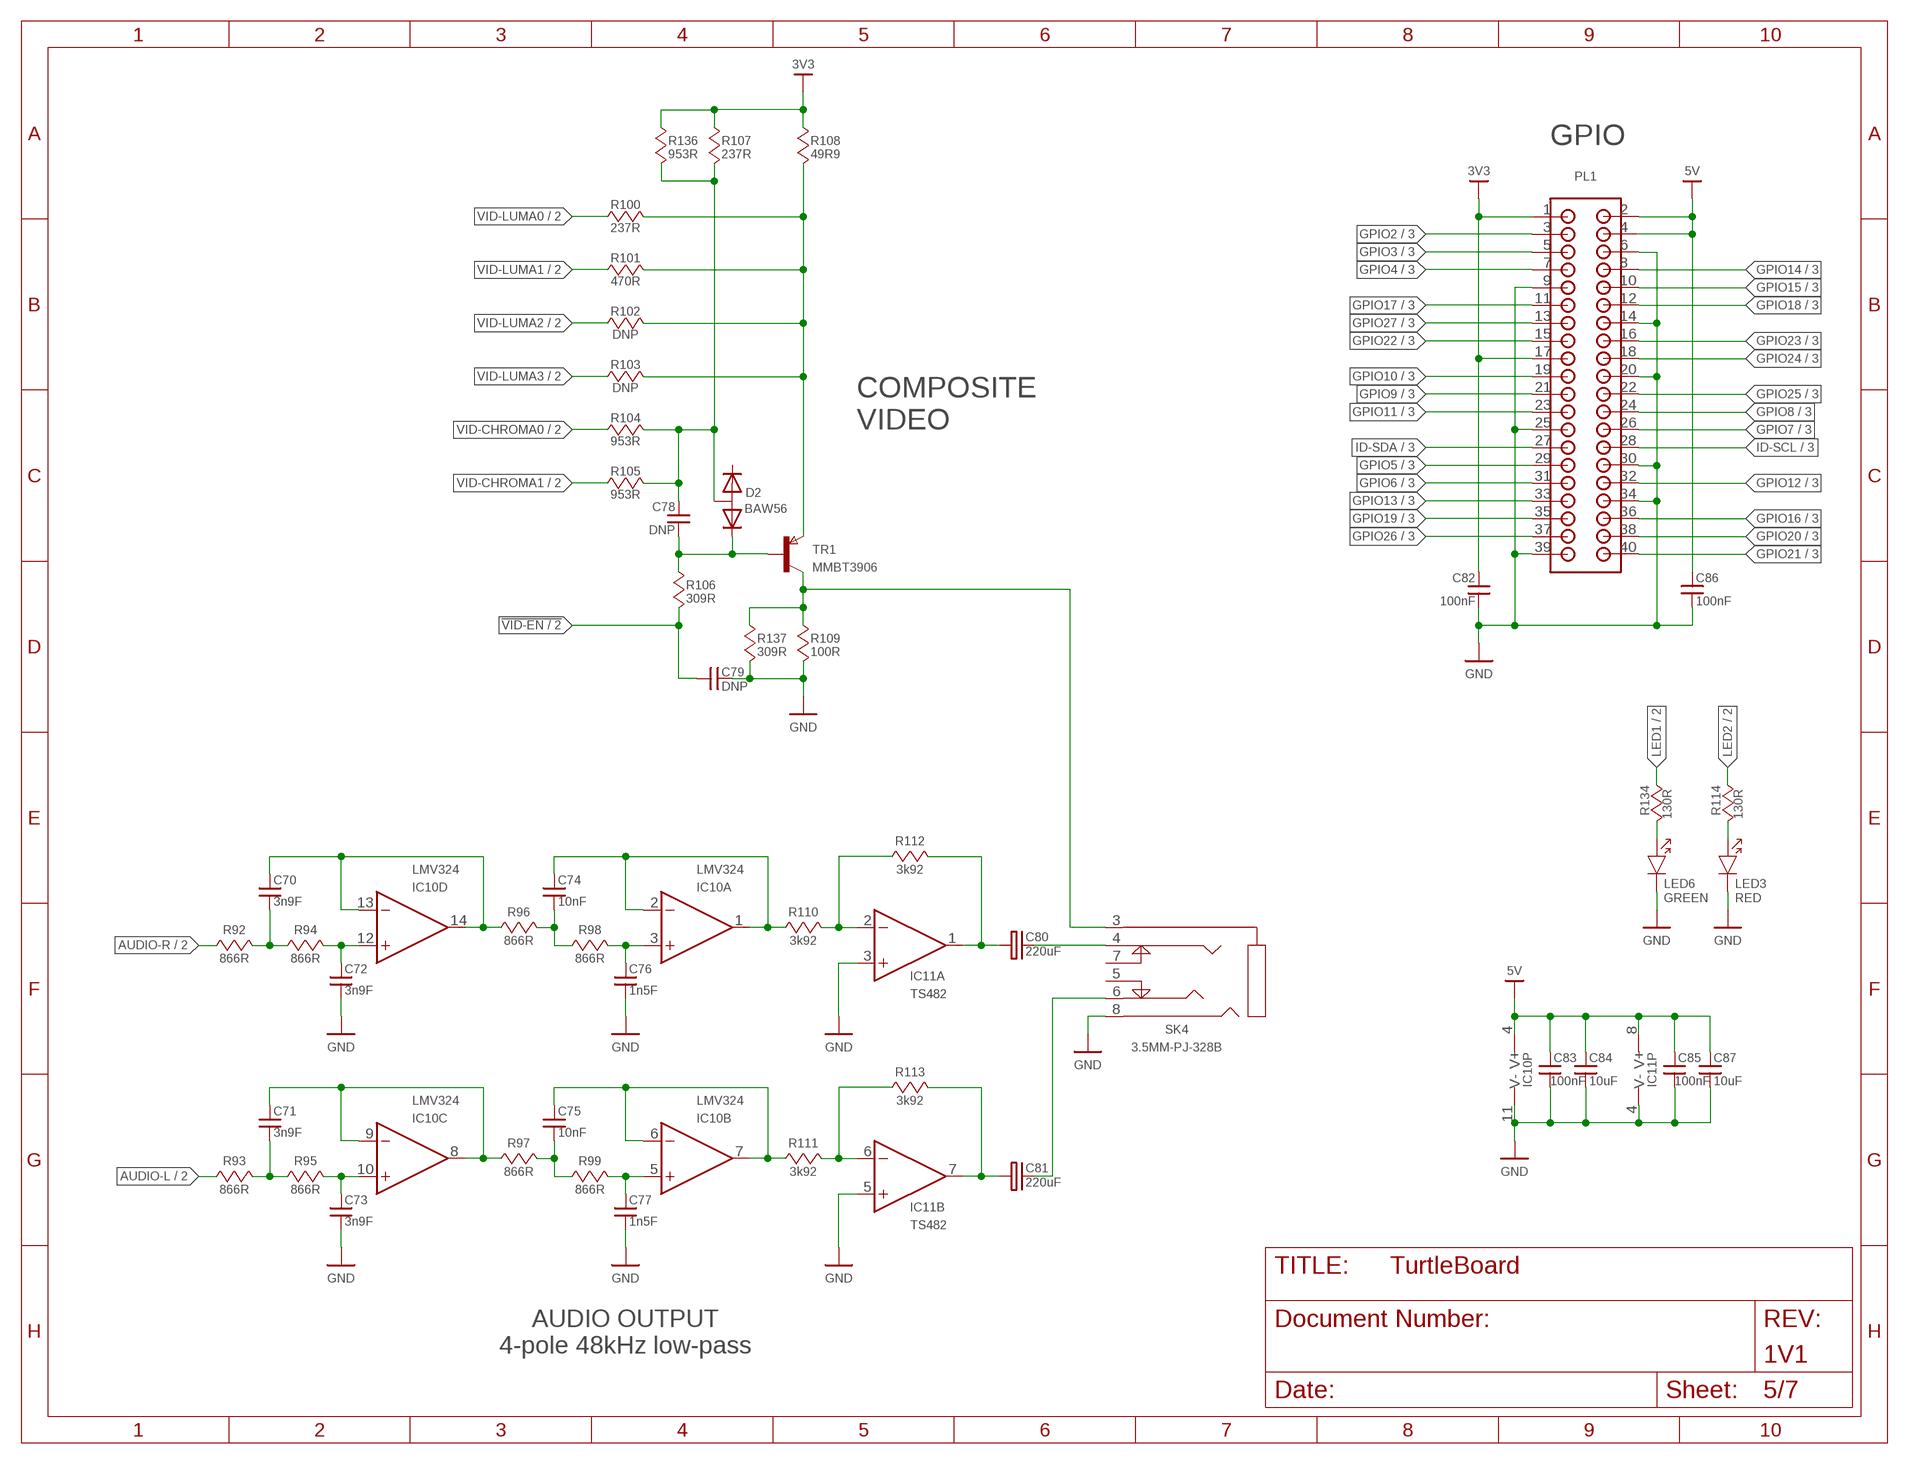
[diagram p4: schematic, sheet 5]

### Parts
C70  3n9F  C-0402  [0402]
C71  3n9F  C-0402  [0402]
C72  3n9F  C-0402  [0402]
C73  3n9F  C-0402  [0402]
C74  10nF  C-0402  [0402]
C75  10nF  C-0402  [0402]
C76  1n5F  C-0402  [0402]
C77  1n5F  C-0402  [0402]
C78  DNP  C-0402  [0402]
C79  DNP  C-0402  [0402]
C80  220uF  CP-6.3DIA  [CP-6.3DIA]
C81  220uF  CP-6.3DIA  [CP-6.3DIA]
C82  100nF  C-0402  [0402]
C83  100nF  C-0402  [0402]
C84  10uF  C805  [0805]
C85  100nF  C-0402  [0402]
C86  100nF  C-0402  [0402]
C87  10uF  C805  [0805]
D2  BAW56  D-DUAL-COMMON-ANODESC-75  [SC-75]
IC10  LMV324  OPAMP-QUAD  [TSSOP14]
IC11  TS482  OP-AMP-DUAL-MSOP8  [MSOP08]
LED3  RED  LED-603  [0603-LED]
LED6  GREEN  LED-603  [0603-LED]
PL1  2X20-HEADER  [2X20_0.1"-HEADER]
R92  866R  R-0402  [0402]
R93  866R  R-0402  [0402]
R94  866R  R-0402  [0402]
R95  866R  R-0402  [0402]
R96  866R  R-0402  [0402]
R97  866R  R-0402  [0402]
R98  866R  R-0402  [0402]
R99  866R  R-0402  [0402]
R100  237R  R-0402  [0402]
R101  470R  R-0402  [0402]
R102  DNP  R-0402  [0402]
R103  DNP  R-0402  [0402]
R104  953R  R-0402  [0402]
R105  953R  R-0402  [0402]
R106  309R  R-0402  [0402]
R107  237R  R-0402  [0402]
R108  49R9  R-0402  [0402]
R109  100R  R-0402  [0402]
R110  3k92  R-0402  [0402]
R111  3k92  R-0402  [0402]
R112  3k92  R-0402  [0402]
R113  3k92  R-0402  [0402]
R114  130R  R-0402  [0402]
R134  130R  R-0402  [0402]
R136  953R  R-0402  [0402]
R137  309R  R-0402  [0402]
SK4  3.5MM-PJ-328B  [3.5MM-PJ-328B]
TR1  MMBT3906  PNP-SOT23  [SOT23]

### Nets
3V3: C82.1 PL1.1 PL1.17 R107.2 R108.2 R136.2 ; also sheet 1,2,3,7
5V: C83.2 C84.2 C85.2 C86.1 C87.2 IC10.4(P:V+) IC11.8(P:V+) PL1.2 PL1.4 ; also sheet 2,6,7
!VID-EN: C79.1 R106.1 ; also sheet 2
AUDIO-L: R93.1 ; also sheet 2
AUDIO-R: R92.1 ; also sheet 2
GND: C72.1 C73.1 C76.1 C77.1 C79.2 C82.2 C83.1 C84.1 C85.1 C86.2 C87.1 IC10.11(P:V-) IC11.3(A:+IN) IC11.4(P:V-) IC11.5(B:+IN) LED3.C LED6.C PL1.6 PL1.9 PL1.14 PL1.20 PL1.25 PL1.30 PL1.34 PL1.39 R109.1 R137.1 SK4.8 ; also sheet 1,2,3,4,6,7
GPIO2: PL1.3 ; also sheet 3
GPIO3: PL1.5 ; also sheet 3
GPIO4: PL1.7 ; also sheet 3
GPIO5: PL1.29 ; also sheet 3
GPIO6: PL1.31 ; also sheet 3
GPIO7: PL1.26 ; also sheet 3
GPIO8: PL1.24 ; also sheet 3
GPIO9: PL1.21 ; also sheet 3
GPIO10: PL1.19 ; also sheet 3
GPIO11: PL1.23 ; also sheet 3
GPIO12: PL1.32 ; also sheet 3
GPIO13: PL1.33 ; also sheet 3
GPIO14: PL1.8 ; also sheet 3
GPIO15: PL1.10 ; also sheet 3
GPIO16: PL1.36 ; also sheet 3
GPIO17: PL1.11 ; also sheet 3
GPIO18: PL1.12 ; also sheet 3
GPIO19: PL1.35 ; also sheet 3
GPIO20: PL1.38 ; also sheet 3
GPIO21: PL1.40 ; also sheet 3
GPIO22: PL1.15 ; also sheet 3
GPIO23: PL1.16 ; also sheet 3
GPIO24: PL1.18 ; also sheet 3
GPIO25: PL1.22 ; also sheet 3
GPIO26: PL1.37 ; also sheet 3
GPIO27: PL1.13 ; also sheet 3
ID-SCL: PL1.28 ; also sheet 3
ID-SDA: PL1.27 ; also sheet 3
LED1: R134.2 ; also sheet 2
LED2: R114.2 ; also sheet 2
N$18: IC11.2(A:-IN) R110.2 R112.1
N$19: C70.2 IC10.13(D:-IN) IC10.14(D:OUT) R96.1
N$30: C70.1 R92.2 R94.1
N$40: C72.2 IC10.12(D:+IN) R94.2
N$41: LED3.A R114.1
N$47: C80.-(MINUS) SK4.4
N$48: C81.-(MINUS) SK4.6
N$49: C78.1 D2.3(A) R104.2 R105.2 R107.1 R136.1
N$50: LED6.A R134.1
N$65: C78.2 D2.2(K2) R106.2 TR1.1(B)
N$70: C74.2 IC10.1(A:OUT) IC10.2(A:-IN) R110.1
N$71: C74.1 R96.2 R98.1
N$72: C76.2 IC10.3(A:+IN) R98.2
N$73: C71.2 IC10.8(C:OUT) IC10.9(C:-IN) R97.1
N$74: C80.+(PLUS) IC11.1(A:OUT) R112.2
N$75: C71.1 R93.2 R95.1
N$76: C73.2 IC10.10(C:+IN) R95.2
N$77: C75.2 IC10.6(B:-IN) IC10.7(B:OUT) R111.1
N$78: C75.1 R97.2 R99.1
N$79: C77.2 IC10.5(B:+IN) R99.2
N$80: IC11.6(B:-IN) R111.2 R113.1
N$81: C81.+(PLUS) IC11.7(B:OUT) R113.2
N$82: R109.2 R137.2 SK4.3 TR1.3(C)
N$83: R100.2 R101.2 R102.2 R103.2 R108.1 TR1.2(E)
VID-CHROMA0: R104.1 ; also sheet 2
VID-CHROMA1: R105.1 ; also sheet 2
VID-LUMA0: R100.1 ; also sheet 2
VID-LUMA1: R101.1 ; also sheet 2
VID-LUMA2: R102.1 ; also sheet 2
VID-LUMA3: R103.1 ; also sheet 2
Unconnected: D2.1(K1) SK4.5 SK4.7

### Notes on the sheet
- GPIO
- COMPOSITE
  VIDEO
- AUDIO OUTPUT
  4-pole 48kHz low-pass

## Sheet 6 of 7
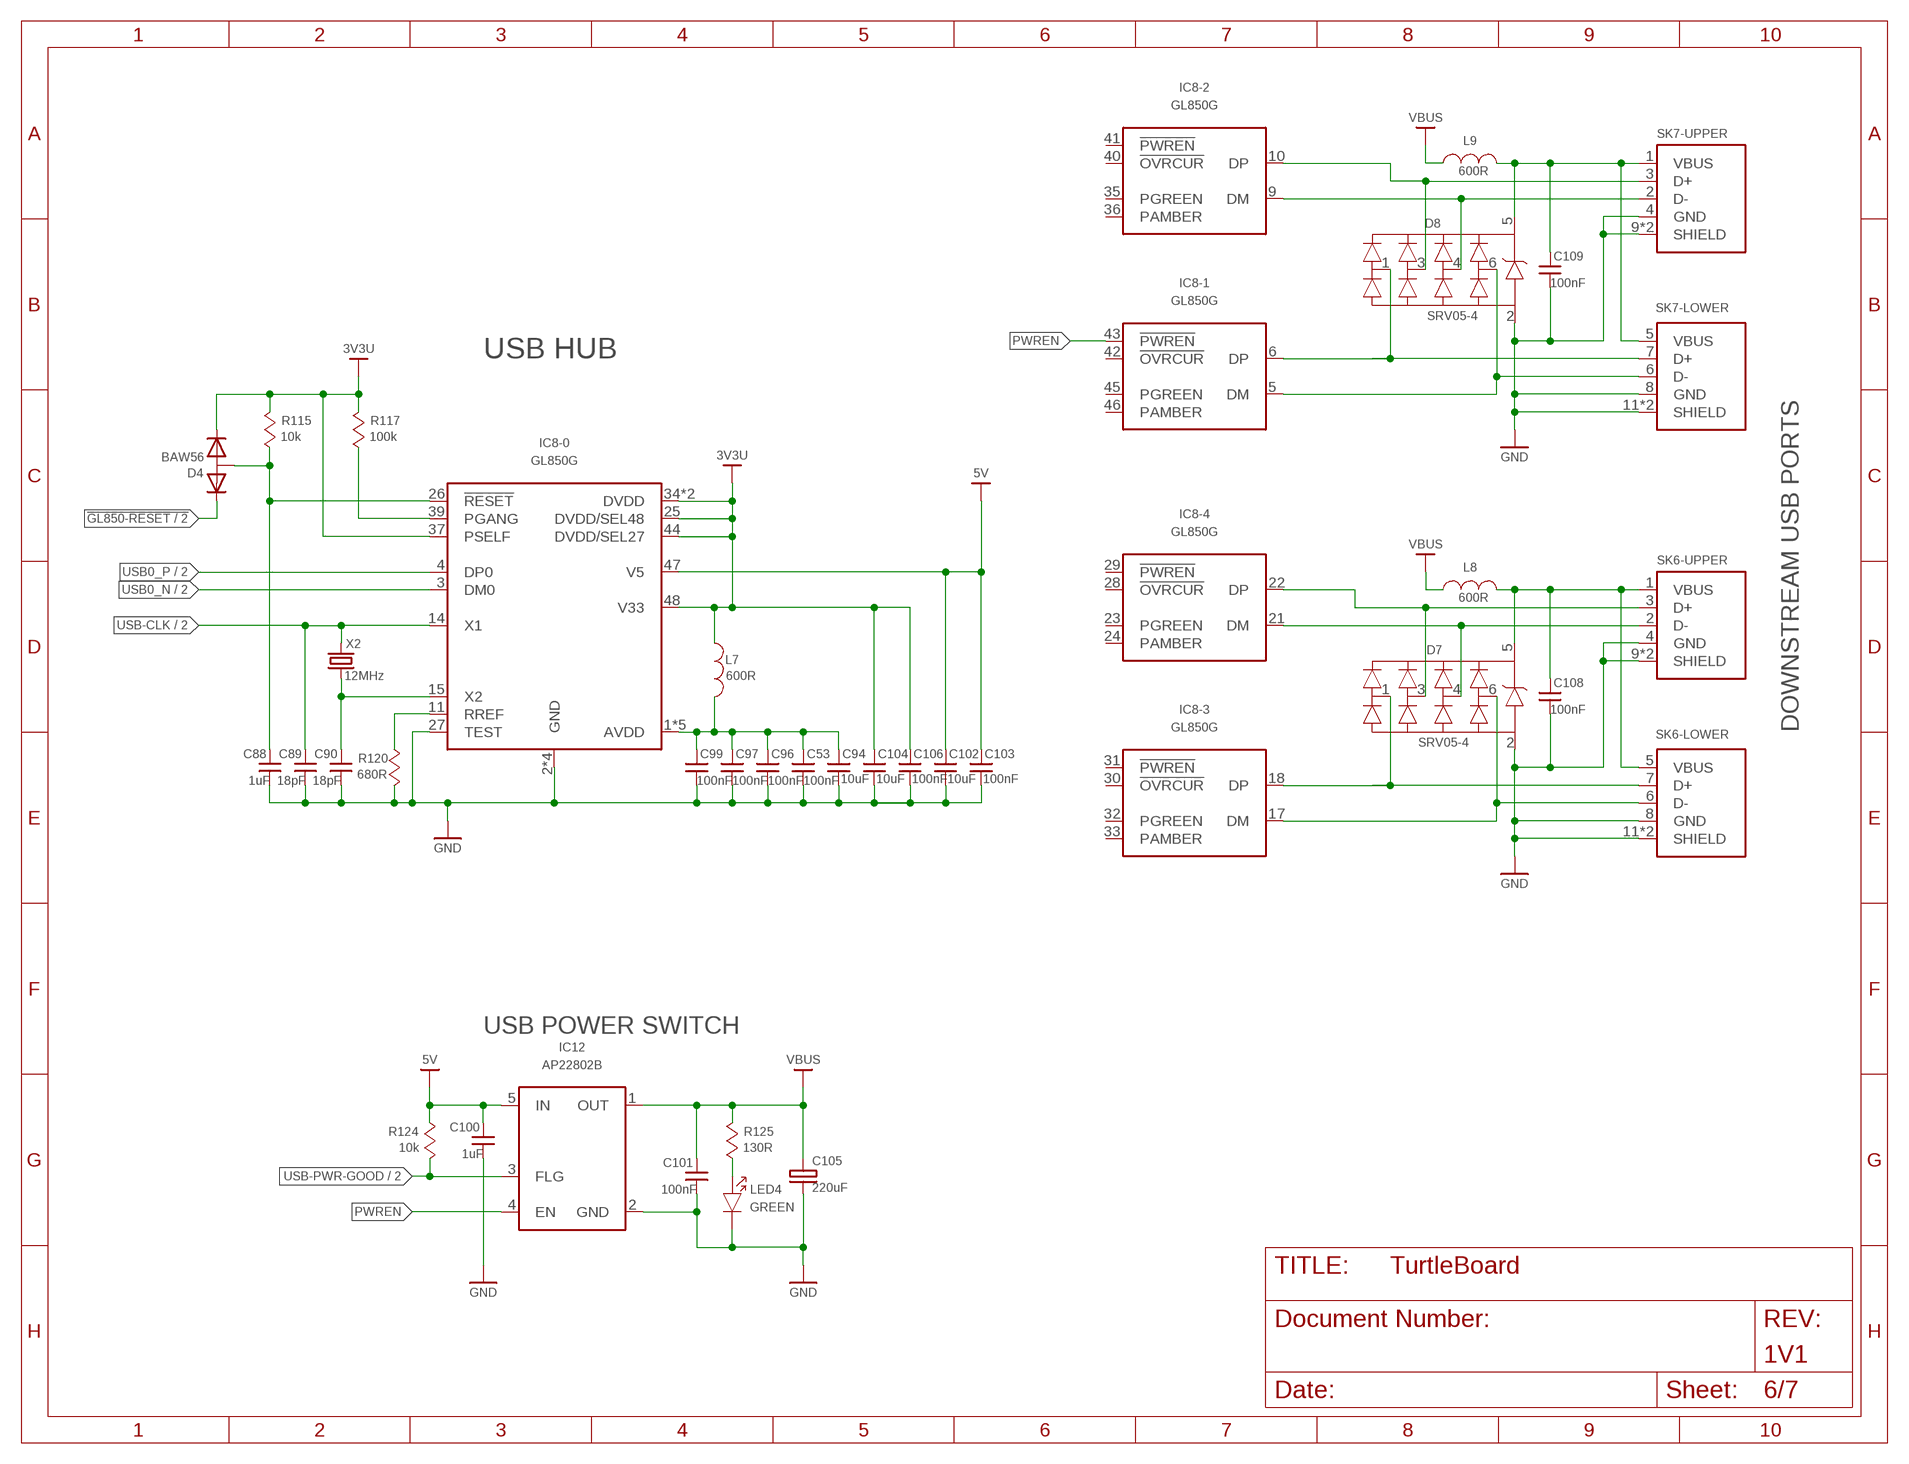
[diagram p5: schematic, sheet 6]

### Parts
C53  100nF  C-0402  [0402]
C88  1uF  C-0402  [0402]
C89  18pF  C-0402  [0402]
C90  18pF  C-0402  [0402]
C94  10uF  C805  [0805]
C96  100nF  C-0402  [0402]
C97  100nF  C-0402  [0402]
C99  100nF  C-0402  [0402]
C100  1uF  C-0402  [0402]
C101  100nF  C-0402  [0402]
C102  10uF  C805  [0805]
C103  100nF  C-0402  [0402]
C104  10uF  C805  [0805]
C105  220uF  CP-6.3DIA  [CP-6.3DIA]
C106  100nF  C-0402  [0402]
C108  100nF  C-0402  [0402]
C109  100nF  C-0402  [0402]
D4  BAW56  D-DUAL-COMMON-ANODESC-75  [SC-75]
D7  SRV05-4  [SOT23-6L]
D8  SRV05-4  [SOT23-6L]
IC8  GL850G  GL850G-LQFP-LQFP  [LQFP48]
IC12  AP22802B  USB-PWR-SW-SOT25  [SOT23-5]
L7  600R  L-0805  [C0805]
L8  600R  L-0805  [C0805]
L9  600R  L-0805  [C0805]
LED4  GREEN  LED-603  [0603-LED]
R115  10k  R-0402  [0402]
R117  100k  R-0402  [0402]
R120  680R  R-0402  [0402]
R124  10k  R-0402  [0402]
R125  130R  R-0402  [0402]
SK6  USB-A-DUAL  [USB-A-DUAL]
SK7  USB-A-DUAL  [USB-A-DUAL]
X2  12MHz  CRYSTAL-2PIN-32X25  [XTAL-SMD-32X25]

### Nets
3V3A: C53.2 C94.2 C96.2 C97.2 C99.2 IC8.1(-0:AVDD) IC8.7(-0:AVDD) IC8.12(-0:AVDD) IC8.16(-0:AVDD) IC8.19(-0:AVDD) L7.1
3V3U: C104.2 C106.2 D4.2(K2) IC8.25(-0:DVDD/SEL48) IC8.34(-0:DVDD) IC8.37(-0:PSELF) IC8.38(-0:DVDD) IC8.44(-0:DVDD/SEL27) IC8.48(-0:V33) L7.2 R115.2 R117.2
5V: C100.2 C102.2 C103.2 IC8.47(-0:V5) IC12.5(IN) R124.2 ; also sheet 2,5,7
!GL850-RESET: D4.1(K1) ; also sheet 2
GND: C53.1 C88.1 C89.1 C90.1 C94.1 C96.1 C97.1 C99.1 C100.1 C101.1 C102.1 C103.1 C104.1 C105.-(MINUS) C106.1 C108.1 C109.1 D7.2(-) D8.2(-) IC8.2(-0:GND) IC8.8(-0:GND) IC8.13(-0:GND) IC8.20(-0:GND) IC8.27(-0:TEST) IC12.2(GND) LED4.C R120.1 SK6.4(-UPPER:GND) SK6.8(-LOWER:GND) SK6.9(-UPPER:SHIELD) SK6.10(-UPPER:SHIELD) SK6.11(-LOWER:SHIELD) SK6.12(-LOWER:SHIELD) SK7.4(-UPPER:GND) SK7.8(-LOWER:GND) SK7.9(-UPPER:SHIELD) SK7.10(-UPPER:SHIELD) SK7.11(-LOWER:SHIELD) SK7.12(-LOWER:SHIELD) ; also sheet 1,2,3,4,5,7
N$52: IC8.11(-0:RREF) R120.2
N$55: IC8.39(-0:PGANG) R117.1
N$63: C88.2 D4.3(A) IC8.26(-0:!RESET) R115.1
N$64: C108.2 D7.5(+) L8.2 SK6.1(-UPPER:VBUS) SK6.5(-LOWER:VBUS)
N$67: C109.2 D8.5(+) L9.2 SK7.1(-UPPER:VBUS) SK7.5(-LOWER:VBUS)
N$68: LED4.A R125.1
PWREN: IC8.43(-1:!PWREN) IC12.4(EN)
USB0_N: IC8.3(-0:DM0) ; also sheet 2
USB0_P: IC8.4(-0:DP0) ; also sheet 2
USB1_N: D7.4(D3) IC8.21(-4:DM) SK6.2(-UPPER:D-)
USB1_P: D7.3(D2) IC8.22(-4:DP) SK6.3(-UPPER:D+)
USB2_N: D7.6(D4) IC8.17(-3:DM) SK6.6(-LOWER:D-)
USB2_P: D7.1(D1) IC8.18(-3:DP) SK6.7(-LOWER:D+)
USB3_N: D8.4(D3) IC8.9(-2:DM) SK7.2(-UPPER:D-)
USB3_P: D8.3(D2) IC8.10(-2:DP) SK7.3(-UPPER:D+)
USB4_N: D8.6(D4) IC8.5(-1:DM) SK7.6(-LOWER:D-)
USB4_P: D8.1(D1) IC8.6(-1:DP) SK7.7(-LOWER:D+)
USB-CLK: C89.2 IC8.14(-0:X1) X2.3 ; also sheet 2
USB-CLK2: C90.2 IC8.15(-0:X2) X2.1
USB-PWR-GOOD: IC12.3(FLG) R124.1 ; also sheet 2
VBUS: C101.2 C105.+(PLUS) IC12.1(OUT) L8.1 L9.1 R125.2
Unconnected: IC8.23(-4:PGREEN) IC8.24(-4:PAMBER) IC8.28(-4:!OVRCUR) IC8.29(-4:!PWREN) IC8.30(-3:!OVRCUR) IC8.31(-3:!PWREN) IC8.32(-3:PGREEN) IC8.33(-3:PAMBER) IC8.35(-2:PGREEN) IC8.36(-2:PAMBER) IC8.40(-2:!OVRCUR) IC8.41(-2:!PWREN) IC8.42(-1:!OVRCUR) IC8.45(-1:PGREEN) IC8.46(-1:PAMBER)

### Notes on the sheet
- USB HUB
- DOWNSTREAM USB PORTS
- USB POWER SWITCH

## Sheet 7 of 7
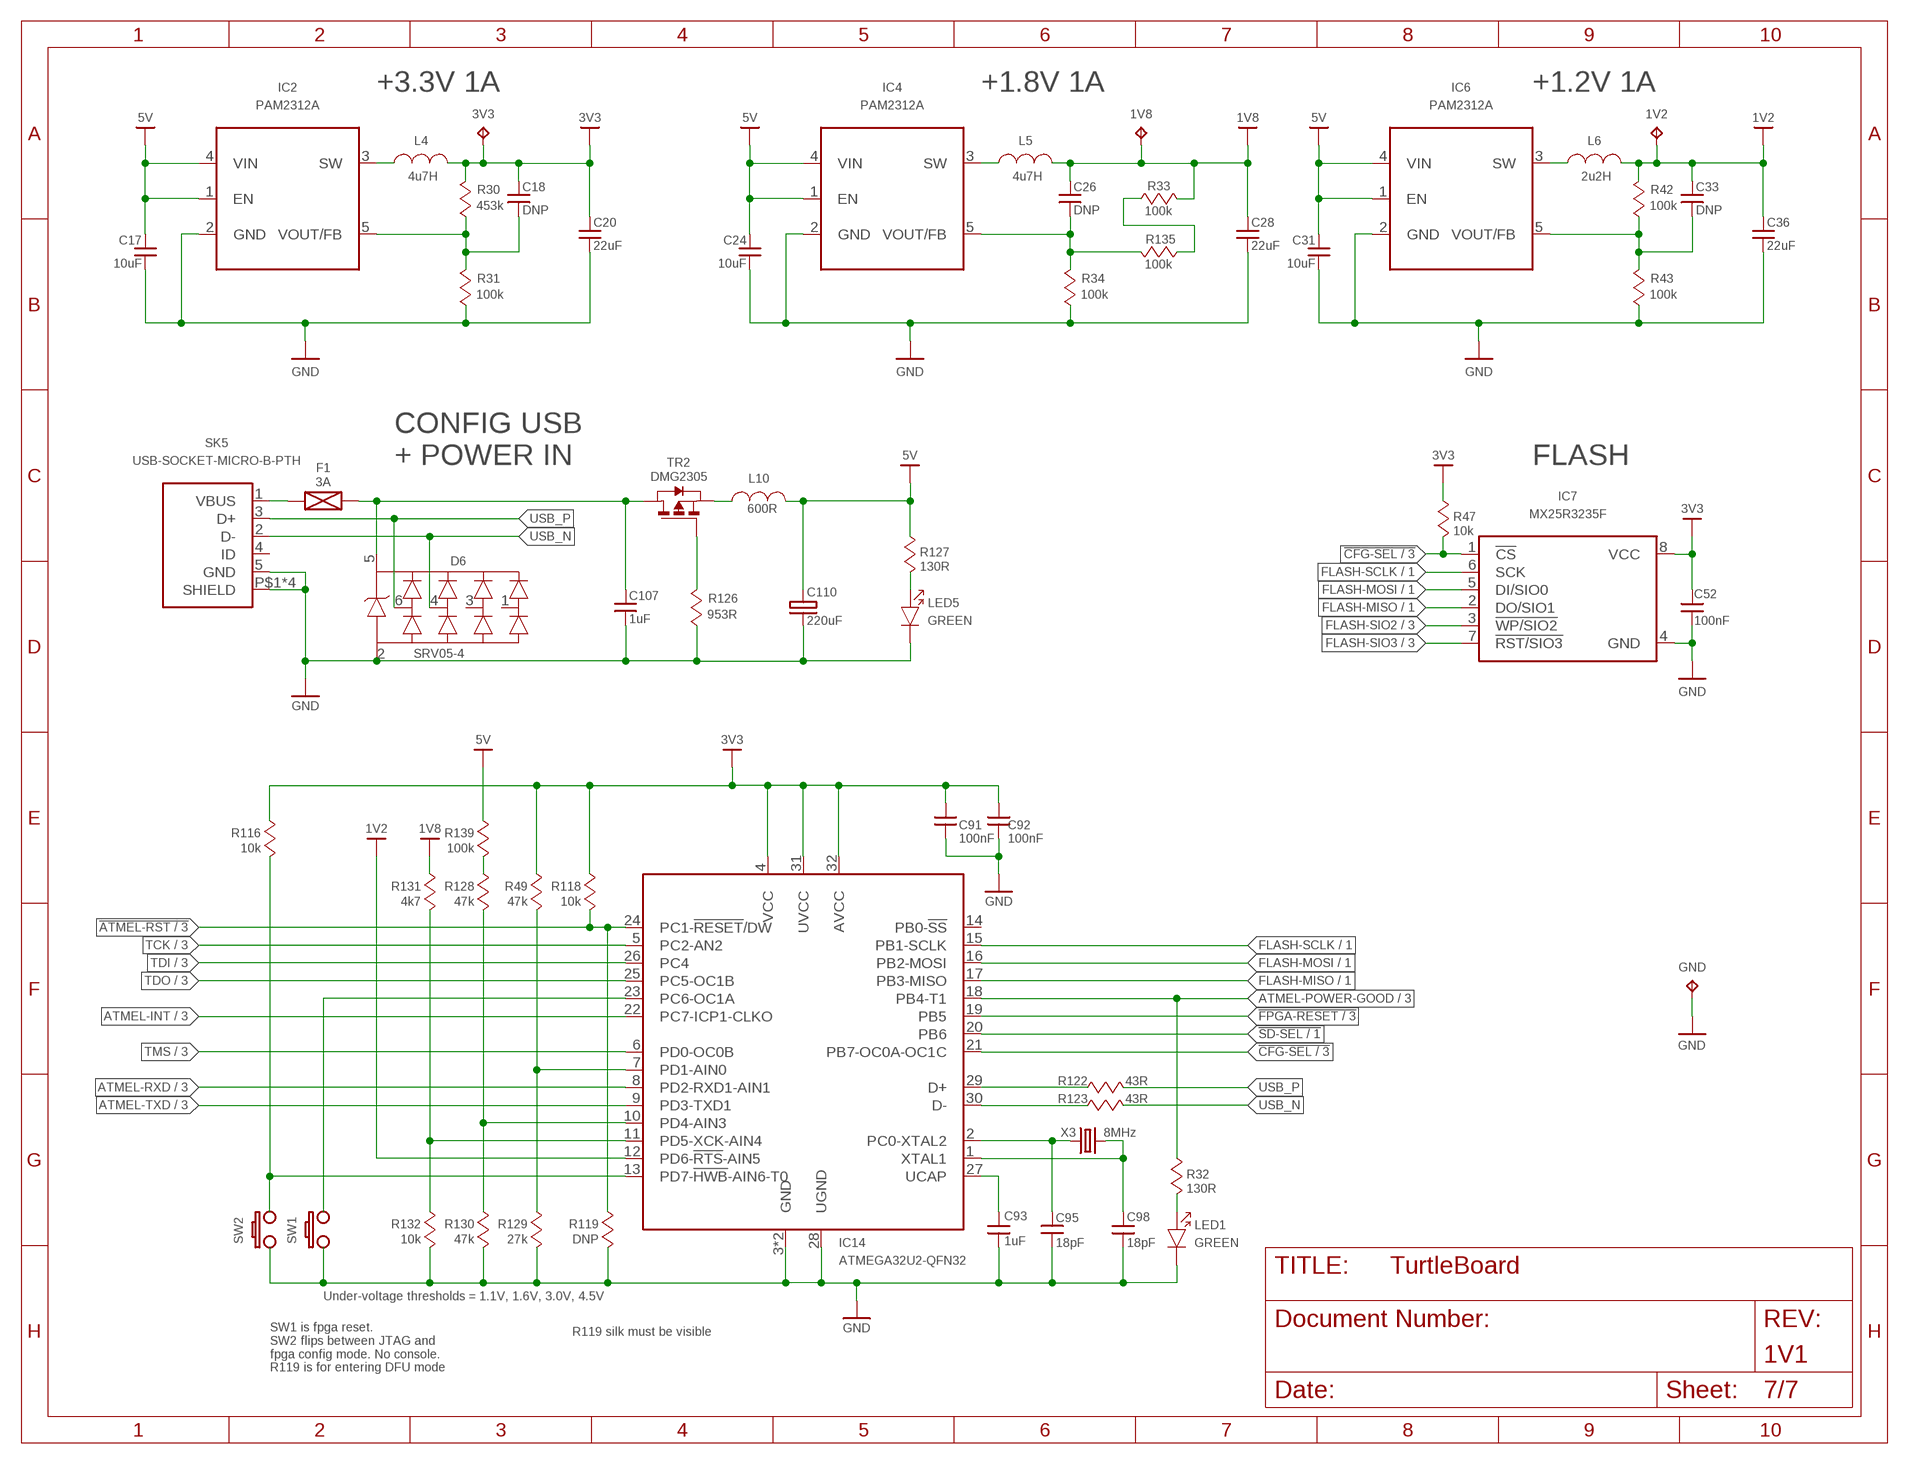
[diagram p6: schematic, sheet 7]

### Parts
C17  10uF  C805  [0805]
C18  DNP  C-0402  [0402]
C20  22uF  C805  [0805]
C24  10uF  C805  [0805]
C26  DNP  C-0402  [0402]
C28  22uF  C805  [0805]
C31  10uF  C805  [0805]
C33  DNP  C-0402  [0402]
C36  22uF  C805  [0805]
C52  100nF  C-0402  [0402]
C91  100nF  C-0402  [0402]
C92  100nF  C-0402  [0402]
C93  1uF  C-0402  [0402]
C95  18pF  C-0402  [0402]
C98  18pF  C-0402  [0402]
C107  1uF  C-0402  [0402]
C110  220uF  CP-6.3DIA  [CP-6.3DIA]
D6  SRV05-4  [SOT23-6L]
F1  3A  FUSE-1812  [C1812]
IC2  PAM2312A  PAM2312  [TSOT23-5]
IC4  PAM2312A  PAM2312  [TSOT23-5]
IC6  PAM2312A  PAM2312  [TSOT23-5]
IC7  MX25R3235F  SPI-FLASH-QUADSO8-WIDE  [SOIJ-8]
IC14  ATMEGA32U2-QFN32  [QFN-32]
L4  4u7H  L-SRN6045  [SRN6045]
L5  4u7H  L-SRN6045  [SRN6045]
L6  2u2H  L-SRN6045  [SRN6045]
L10  600R  L-1210  [C1210]
LED1  GREEN  LED-603  [0603-LED]
LED5  GREEN  LED-603  [0603-LED]
R30  453k  R-0402  [0402]
R31  100k  R-0402  [0402]
R32  130R  R-0402  [0402]
R33  100k  R-0402  [0402]
R34  100k  R-0402  [0402]
R42  100k  R-0402  [0402]
R43  100k  R-0402  [0402]
R47  10k  R-0402  [0402]
R49  47k  R-0402  [0402]
R116  10k  R-0402  [0402]
R118  10k  R-0402  [0402]
R119  DNP  R603  [0603]
R122  43R  R-0402  [0402]
R123  43R  R-0402  [0402]
R126  953R  R-0402  [0402]
R127  130R  R-0402  [0402]
R128  47k  R-0402  [0402]
R129  27k  R-0402  [0402]
R130  47k  R-0402  [0402]
R131  4k7  R-0402  [0402]
R132  10k  R-0402  [0402]
R135  100k  R-0402  [0402]
R139  100k  R-0402  [0402]
SK5  USB-SOCKET-MICRO-B-PTH  [USB-MICRO-B-PTH]
SW1  SWITCH-SPSTTACT-6X3  [TACT-6X3]
SW2  SWITCH-SPSTTACT-6X3  [TACT-6X3]
TP1  3V3  TPP1-10  [P1-10]
TP2  1V8  TPP1-10  [P1-10]
TP3  GND  TPP1-10  [P1-10]
TP4  1V2  TPP1-10  [P1-10]
TR2  DMG2305  PMOS-SOT23  [SOT23]
X3  8MHz  CRYSTAL-2PIN-ABM3  [CRYSTAL-ABM3]

### Nets
1V2: C33.1 C36.2 IC14.12(PD6-!RTS!-AIN5) L6.2 R42.2 TP4.1(TP) ; also sheet 3
1V8: C26.1 C28.2 L5.2 R33.2 R131.2 TP2.1(TP) ; also sheet 4
3V3: C18.1 C20.2 C91.2 C92.2 IC14.4(VCC) IC14.31(UVCC) IC14.32(AVCC) L4.2 R30.2 R47.2 R49.2 R116.2 R118.2 TP1.1(TP) ; also sheet 1,2,3,5
5V: C17.2 C24.2 C31.2 C110.+(PLUS) IC2.1(EN) IC2.4(VIN) IC4.1(EN) IC4.4(VIN) IC6.1(EN) IC6.4(VIN) L10.2 R127.2 R139.2 ; also sheet 2,5,6
!ATMEL-RST: IC14.24(PC1-!RESET!/DW) R118.1 R119.2 ; also sheet 3
!CFG-SEL: IC7.1(!CS) IC14.21(PB7-OC0A-OC1C) R47.1 ; also sheet 3
!FPGA-RESET: IC14.19(PB5) ; also sheet 3
!SD-SEL: IC14.20(PB6) ; also sheet 1,3
ATMEL-INT: IC14.22(PC7-ICP1-CLKO) ; also sheet 3
ATMEL-POWER-GOOD: IC14.18(PB4-T1) R32.2 ; also sheet 3
ATMEL-RXD: IC14.8(PD2-RXD1-AIN1) ; also sheet 3
ATMEL-TXD: IC14.9(PD3-TXD1) ; also sheet 3
FLASH-MISO: IC7.2(DO/SIO1) IC14.17(PB3-MISO) ; also sheet 1,3
FLASH-MOSI: IC7.5(DI/SIO0) IC14.16(PB2-MOSI) ; also sheet 1,3
FLASH-SCLK: IC7.6(SCK) IC14.15(PB1-SCLK) ; also sheet 1,3
FLASH-SIO2: IC7.3(!WP/SIO2) ; also sheet 3
FLASH-SIO3: IC7.7(!RST/SIO3) ; also sheet 3
GND: C17.1 C20.1 C24.1 C28.1 C31.1 C36.1 C52.1 C91.1 C92.1 C93.1 C95.1 C98.1 C107.2 C110.-(MINUS) D6.2(-) IC2.2(GND) IC4.2(GND) IC6.2(GND) IC7.4(GND) IC14.3(GND) IC14.28(UGND) IC14.P(GND) LED1.C LED5.C R31.1 R34.1 R43.1 R119.1 R126.1 R129.1 R130.1 R132.1 SK5.5(GND) SK5.P$1(SHIELD) SK5.P$2(SHIELD) SK5.P$3(SHIELD) SK5.P$4(SHIELD) SW1.P$2 SW2.P$2 TP3.1(TP) ; also sheet 1,2,3,4,5,6
N$10: LED1.A R32.1
N$13: C93.2 IC14.27(UCAP)
N$15: IC14.29(D+) R122.1
N$16: IC14.30(D-) R123.1
N$24: C107.1 D6.5(+) F1.1 TR2.3(D)
N$25: F1.2 SK5.1(VBUS)
N$26: IC2.3(SW) L4.1
N$27: IC6.3(SW) L6.1
N$28: C33.2 IC6.5(VOUT/FB) R42.1 R43.2
N$29: C18.2 IC2.5(VOUT/FB) R30.1 R31.2
N$37: R126.2 TR2.1(G)
N$38: LED5.A R127.1
N$39: IC14.13(PD7-!HWB!-AIN6-T0) R116.1 SW2.P$1
N$43: C98.2 IC14.1(XTAL1) X3.2
N$45: C95.2 IC14.2(PC0-XTAL2) X3.1
N$46: IC14.10(PD4-AIN3) R128.1 R130.2
N$51: R33.1 R135.1
N$54: IC4.3(SW) L5.1
N$56: C26.2 IC4.5(VOUT/FB) R34.2 R135.2
N$69: L10.1 TR2.2(S)
N$84: IC14.7(PD1-AIN0) R49.1 R129.2
N$85: IC14.23(PC6-OC1A) SW1.P$1
N$86: IC14.11(PD5-XCK-AIN4) R131.1 R132.2
N$98: R128.2 R139.1
TCK: IC14.5(PC2-AN2) ; also sheet 3
TDI: IC14.26(PC4) ; also sheet 3
TDO: IC14.25(PC5-OC1B) ; also sheet 3
TMS: IC14.6(PD0-OC0B) ; also sheet 3
USB_N: D6.4(D3) R123.2 SK5.2(D-)
USB_P: D6.6(D4) R122.2 SK5.3(D+)
V: C52.2 IC7.8(VCC) ; supply symbol labelled 3V3
Unconnected: D6.1(D1) D6.3(D2) IC14.14(PB0-!SS!) SK5.4(ID)

### Notes on the sheet
- +3.3V 1A | +1.8V 1A | +1.2V 1A
- CONFIG USB
  + POWER IN
- FLASH
- Under-voltage thresholds = 1.1V, 1.6V, 3.0V, 4.5V
- R119 silk must be visible
- SW1 is fpga reset.
  SW2 flips between JTAG and
  fpga config mode. No console.
  R119 is for entering DFU mode

## Library data of the parts
C1-C4 C6-C9 C11-C14 C16 C20 C29 C30 C32 C34 C36 C42 C52 C53 C83 C85 C88-C92 C96 C97 C99-C101 C103 C106-C109 = SEI:C: Ceramic Capacitor SM
C5 C15 C94 C102 C104 = SEI:C: Ceramic Capacitor SM; PN: 1276-2934-1-ND
C10 = SEI:C: Ceramic Capacitor SM; PN: 490-6471-2-ND
C17 C24 C31 = SEI:C: Ceramic Capacitor SM; PN: 490-7207-1-ND
C18 C21 C22 C26 C33 C39-C41 C45 C46 C49-C51 C57-C59 C62-C64 C70-C79 C82 C86 = SEI:C: Ceramic Capacitor SM; PN: 587-1230-1-ND
C23 C38 C44 C48 C56 C61 = SEI:C: Ceramic Capacitor SM; PN: 587-1785-1-ND
C25 C37 C43 C47 C54 C60 C65 = SEI:C: Ceramic Capacitor SM; PN: 399-5620-1-ND
C28 C84 C87 = SEI:C: Ceramic Capacitor SM; PN: 445-1422-1-ND
C66 = SEI:C: Ceramic Capacitor SM; PN: 311-1088-2-ND
C67-C69 = SEI:C: Ceramic Capacitor SM; PN: 587-1228-1-ND
C80 C110 = SEI:CP: Capacitor Polar SM; PN: 493-6210-2-ND
C81 C105 = SEI:CP: Capacitor Polar SM
C93 = SEI:C: Ceramic Capacitor SM; PN: 445-1322-1-ND
C95 C98 = SEI:C: Ceramic Capacitor SM; PN: 311-1415-1-ND
D1 D2 D4 = MC:D-DUAL-COMMON-ANODE; PN: BAW56TT1GOSTR-ND
D6-D8 = MC:SRV05-4; PN: SRV05-4L-TPMSCT-ND
F1 = MC:FUSE; PN: 507-1763-1-ND
H1-H4 = MC:MOUNTING-SCREW: Mounting screw
IC1 = MC:IP101A
IC2 IC4 IC6 = MC:PAM2312; PN: PAM2312AABADJDITR-ND
IC3 = MC:XC6SLX-CSG324: Xilinx Spartan 6 XC6SLX CSG324 package; PN: 122-1673-ND
IC5 = MC:TPD12S521
IC7 = MC:SPI-FLASH-QUAD; PN: 1092-1174-ND
IC8 = MC:GL850G-LQFP
IC9 = MC:MT46H64M16: 1Gb x16 Mobile LPDDR SDRAM; PN: 557-1504-1-ND
IC10 = MC:OPAMP-QUAD; PN: 497-13053-2-ND
IC11 = MC:OP-AMP-DUAL; PN: 497-8110-2-ND
IC12 = MC:USB-PWR-SW
IC14 = MC:ATMEGA32U2; PN: ATMEGA32U2-MU-ND
L1 L2 = SEI:L: Inductor SM; PN: 553-2381-1-ND
L3 = SEI:L: Inductor SM; PN: 1276-6380-2-ND
L4-L6 = MC:L: Vishay VLC6045 6x6 mm; PN: SRN6045-2R2YCT-ND
L7-L9 = MC:L: Vishay VLC6045 6x6 mm; PN: 240-2390-1-ND
L10 = MC:L: Vishay VLC6045 6x6 mm; PN: 587-1755-2-ND
LED1 LED2 LED4 LED5 = SEI:LED
LED3 LED6 = SEI:LED; PN: 475-1409-1-ND
PL1 = MC:2X20-HEADER
R1-R29 R32 R46 R47 R49 R51-R67 R69-R91 R106-R109 R114-R120 R122-R134 R136-R139 = SEI:R: Resistor SM
R30 R31 R33 R34 R42 R43 R92-R105 R110-R113 R135 = SEI:R: Resistor SM; OC_NEWARK: unknown
R35-R41 R44 R45 R48 R50 = SEI:R: Resistor SM; OC_NEWARK: unknown; PARTNO: 311-49.9HRCT-ND
R68 = SEI:R: Resistor SM; OC_NEWARK: unknown; PARTNO: 311-22.0HRTR-ND
SK1 = MC:RJ45+MAG+LED; PN: HR911105A
SK2 = MC:SD-CARD-DETECT: SD-CARD SOCKET; PN: 670-2695-1-ND
SK3 = MC:HDMI; PN: 609-4614-1-ND
SK4 = MC:3.5MM-PJ-328B
SK5 = MC:USB-SOCKET: USB Socket; PN: 609-4618-1-ND
SK6 SK7 = MC:USB-A-DUAL; PN: AE1086-ND
SW1 SW2 = MC:SWITCH-SPST; PN: Mouser 611-RS-282G05A3-SMRT
TP1-TP4 = testpad:TP: Test pad
TR1 = MC:PNP
TR2 = MC:PMOS: MOS FET
X1 = MC:CRYSTAL+EN; PN: FKSSD1025CT-ND
X2 = MC:CRYSTAL-2PIN; PN: 535-10901-1-ND
X3 = MC:CRYSTAL-2PIN; PN: 535-10630-1-ND